# EAGLE design CANTensegrityBoard (EAGLE 6.5.0)

## Sheet 1 of 6
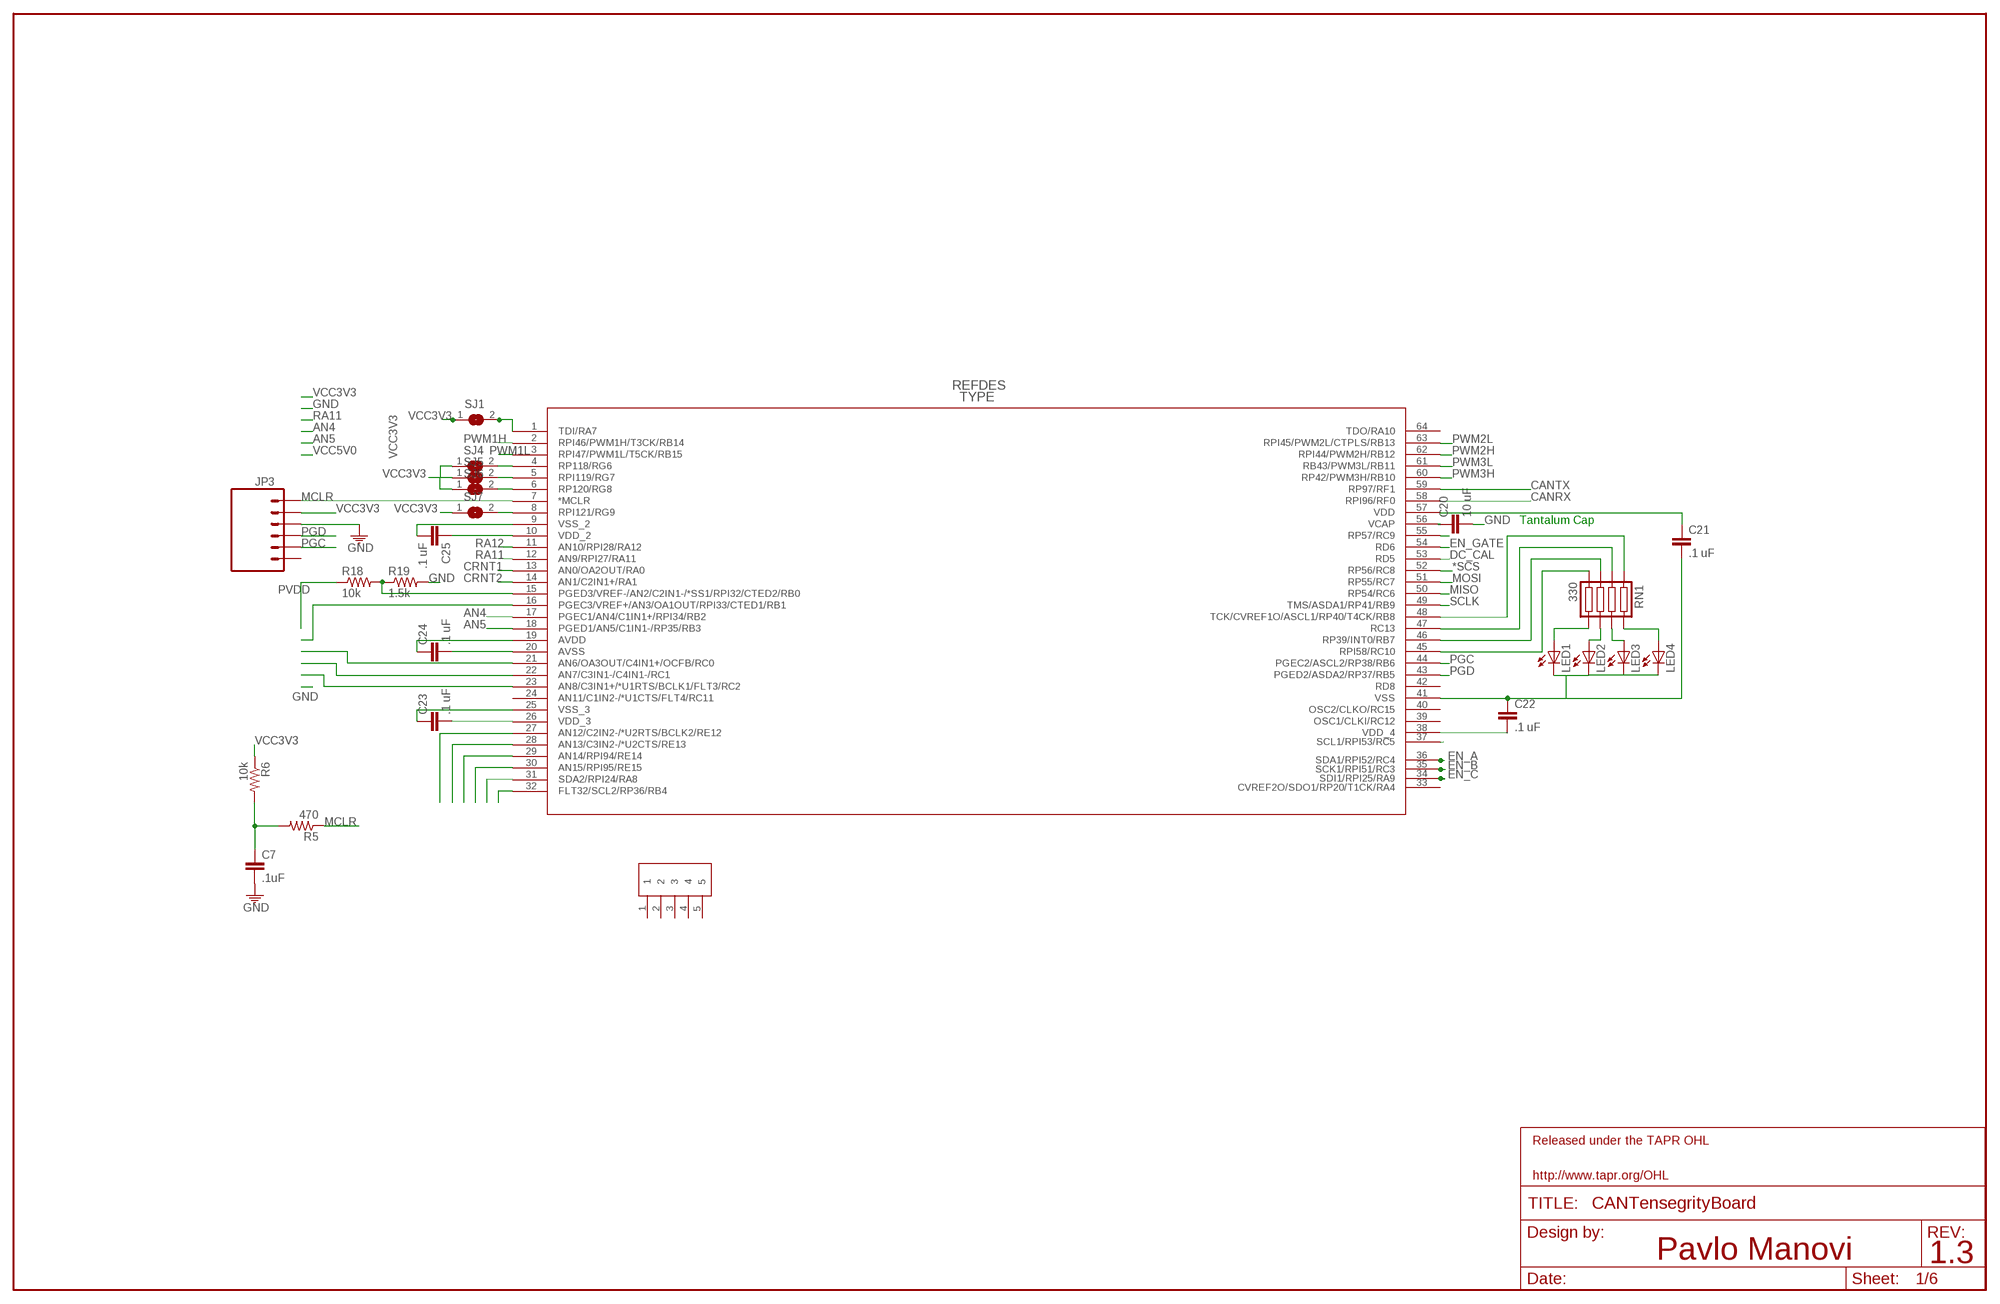
[diagram p0: schematic, sheet 1]

### Parts
C7  .1uF  CAP0805  [0805]
C20  10 uF  CAP1206  [1206]
C21  .1 uF  CAP0805  [0805]
C22  .1 uF  CAP0805  [0805]
C23  .1 uF  CAP0805  [0805]
C24  .1 uF  CAP0805  [0805]
C25  .1 uF  CAP0805  [0805]
JP3  M06LOCK  [1X06_LOCK]
LED1  LED0805  [LED-0805]
LED2  LED0805  [LED-0805]
LED3  LED0805  [LED-0805]
LED4  LED0805  [LED-0805]
R5  470  RESISTOR0805-RES  [0805]
R6  10k  RESISTOR0805-RES  [0805]
R18  10k  RESISTOR0805-RES  [0805]
R19  1.5k  RESISTOR0805-RES  [0805]
RN1  330  RESISTOR_ARRAY-4  [EXB-38V271JV]
SJ1  SJ  [SJ]
SJ4  SJ  [SJ]
SJ5  SJ  [SJ]
SJ6  SJ  [SJ]
SJ7  SJ  [SJ]
U$1  DSPIC33EP128MC502-I/SS  DSPIC33EP256MC50  [QFP64-10X10MC]
U$20  MICROCLASP5  [55932-0510]

### Nets
*SCS [Power]: U$1.52(RP56/RC8) ; also sheet 2
AN4: U$1.17(PGEC1/AN4/C1IN1+/RPI34/RB2)
AN5: U$1.18(PGED1/AN5/C1IN1-/RP35/RB3)
CANRX: U$1.58(RPI96/RF0) ; also sheet 4
CANTX: U$1.59(RP97/RF1) ; also sheet 4
CRNT1: U$1.13(AN0/OA2OUT/RA0) ; also sheet 2
CRNT2: U$1.14(AN1/C2IN1+/RA1) ; also sheet 2
DC_CAL: U$1.53(RD5) ; also sheet 2
EN_A: U$1.36(SDA1/RPI52/RC4) ; also sheet 6
EN_B: U$1.35(SCK1/RPI51/RC3) ; also sheet 6
EN_C: U$1.34(SDI1/RPI25/RA9) ; also sheet 6
EN_GATE: U$1.54(RD6) ; also sheet 2
GND: C7.2 C20.2 C21.2 C22.1 C23.1 C24.2 C25.2 JP3.3 LED1.2(C) LED2.2(C) LED3.2(C) LED4.2(C) R19.2 U$1.9(VSS_2) U$1.20(AVSS) U$1.25(VSS_3) U$1.41(VSS) ; also sheet 3,4,6
MCLR: JP3.1 R5.1 U$1.7(*MCLR)
MISO: U$1.50(RP54/RC6) ; also sheet 2
MOSI: U$1.51(RP55/RC7) ; also sheet 2
N$2: C7.1 R5.2 R6.2
N$5: SJ1.2 U$1.1(TDI/RA7)
N$25: R18.2 R19.1 U$1.15(PGED3/VREF-/AN2/C2IN1-/*SS1/RPI32/CTED2/RB0)
N$26: U$1.37(SCL1/RPI53/RC5)
N$27: SJ4.2 U$1.4(RP118/RG6)
N$28: SJ5.2 U$1.5(RPI119/RG7)
N$29: SJ6.2 U$1.6(RP120/RG8)
N$30: SJ7.2 U$1.8(RPI121/RG9)
N$31: C20.1 U$1.56(VCAP)
N$33: RN1.P$1 U$1.48(TCK/CVREF1O/ASCL1/RP40/T4CK/RB8)
N$41: RN1.P$2 U$1.47(RC13)
N$42: RN1.P$3 U$1.46(RP39/INT0/RB7)
N$43: RN1.P$4 U$1.45(RPI58/RC10)
N$44: LED1.1(A) RN1.P$5
N$45: LED2.1(A) RN1.P$6
N$46: LED3.1(A) RN1.P$7
N$47: LED4.1(A) RN1.P$8
N$48: U$1.32(FLT32/SCL2/RP36/RB4)
N$49: U$1.31(SDA2/RPI24/RA8)
N$50: U$1.30(AN15/RPI95/RE15)
N$51: U$1.29(AN14/RPI94/RE14)
N$52: U$1.28(AN13/C3IN2-/*U2CTS/RE13)
N$53: U$1.27(AN12/C2IN2-/*U2RTS/BCLK2/RE12)
N$55: U$1.16(PGEC3/VREF+/AN3/OA1OUT/RPI33/CTED1/RB1)
N$56: U$1.21(AN6/OA3OUT/C4IN1+/OCFB/RC0)
N$57: U$1.22(AN7/C3IN1-/C4IN1-/RC1)
N$58: U$1.23(AN8/C3IN1+/*U1RTS/BCLK1/FLT3/RC2)
PGC: JP3.5 U$1.44(PGEC2/ASCL2/RP38/RB6)
PGD [small]: JP3.4 U$1.43(PGED2/ASDA2/RP37/RB5)
PVDD [Power]: R18.1 ; also sheet 2,3,5
PWM1H: U$1.2(RPI46/PWM1H/T3CK/RB14) ; also sheet 2
PWM1L: U$1.3(RPI47/PWM1L/T5CK/RB15) ; also sheet 2
PWM2H: U$1.62(RPI44/PWM2H/RB12) ; also sheet 2
PWM2L: U$1.63(RPI45/PWM2L/CTPLS/RB13) ; also sheet 2
PWM3H: U$1.60(RP42/PWM3H/RB10) ; also sheet 2
PWM3L: U$1.61(RB43/PWM3L/RB11) ; also sheet 2
RA11: U$1.12(AN9/RPI27/RA11)
RA12: U$1.11(AN10/RPI28/RA12)
RC9: U$1.55(RP57/RC9)
SCLK: U$1.49(TMS/ASDA1/RP41/RB9) ; also sheet 2
VCC3V3 [Power]: C21.1 C22.2 C23.2 C24.1 C25.1 JP3.2 R6.1 SJ1.1 SJ4.1 SJ5.1 SJ6.1 SJ7.1 U$1.10(VDD_2) U$1.19(AVDD) U$1.26(VDD_3) U$1.38(VDD_4) U$1.57(VDD) ; also sheet 2,4,5,6
Unconnected: JP3.6 U$1.24(AN11/C1IN2-/*U1CTS/FLT4/RC11) U$1.33(CVREF2O/SDO1/RP20/T1CK/RA4) U$1.39(OSC1/CLKI/RC12) U$1.40(OSC2/CLKO/RC15) U$1.42(RD8) U$1.64(TDO/RA10) U$20.1 U$20.2 U$20.3 U$20.4 U$20.5

### Notes on the sheet
- Tantalum Cap

## Sheet 2 of 6
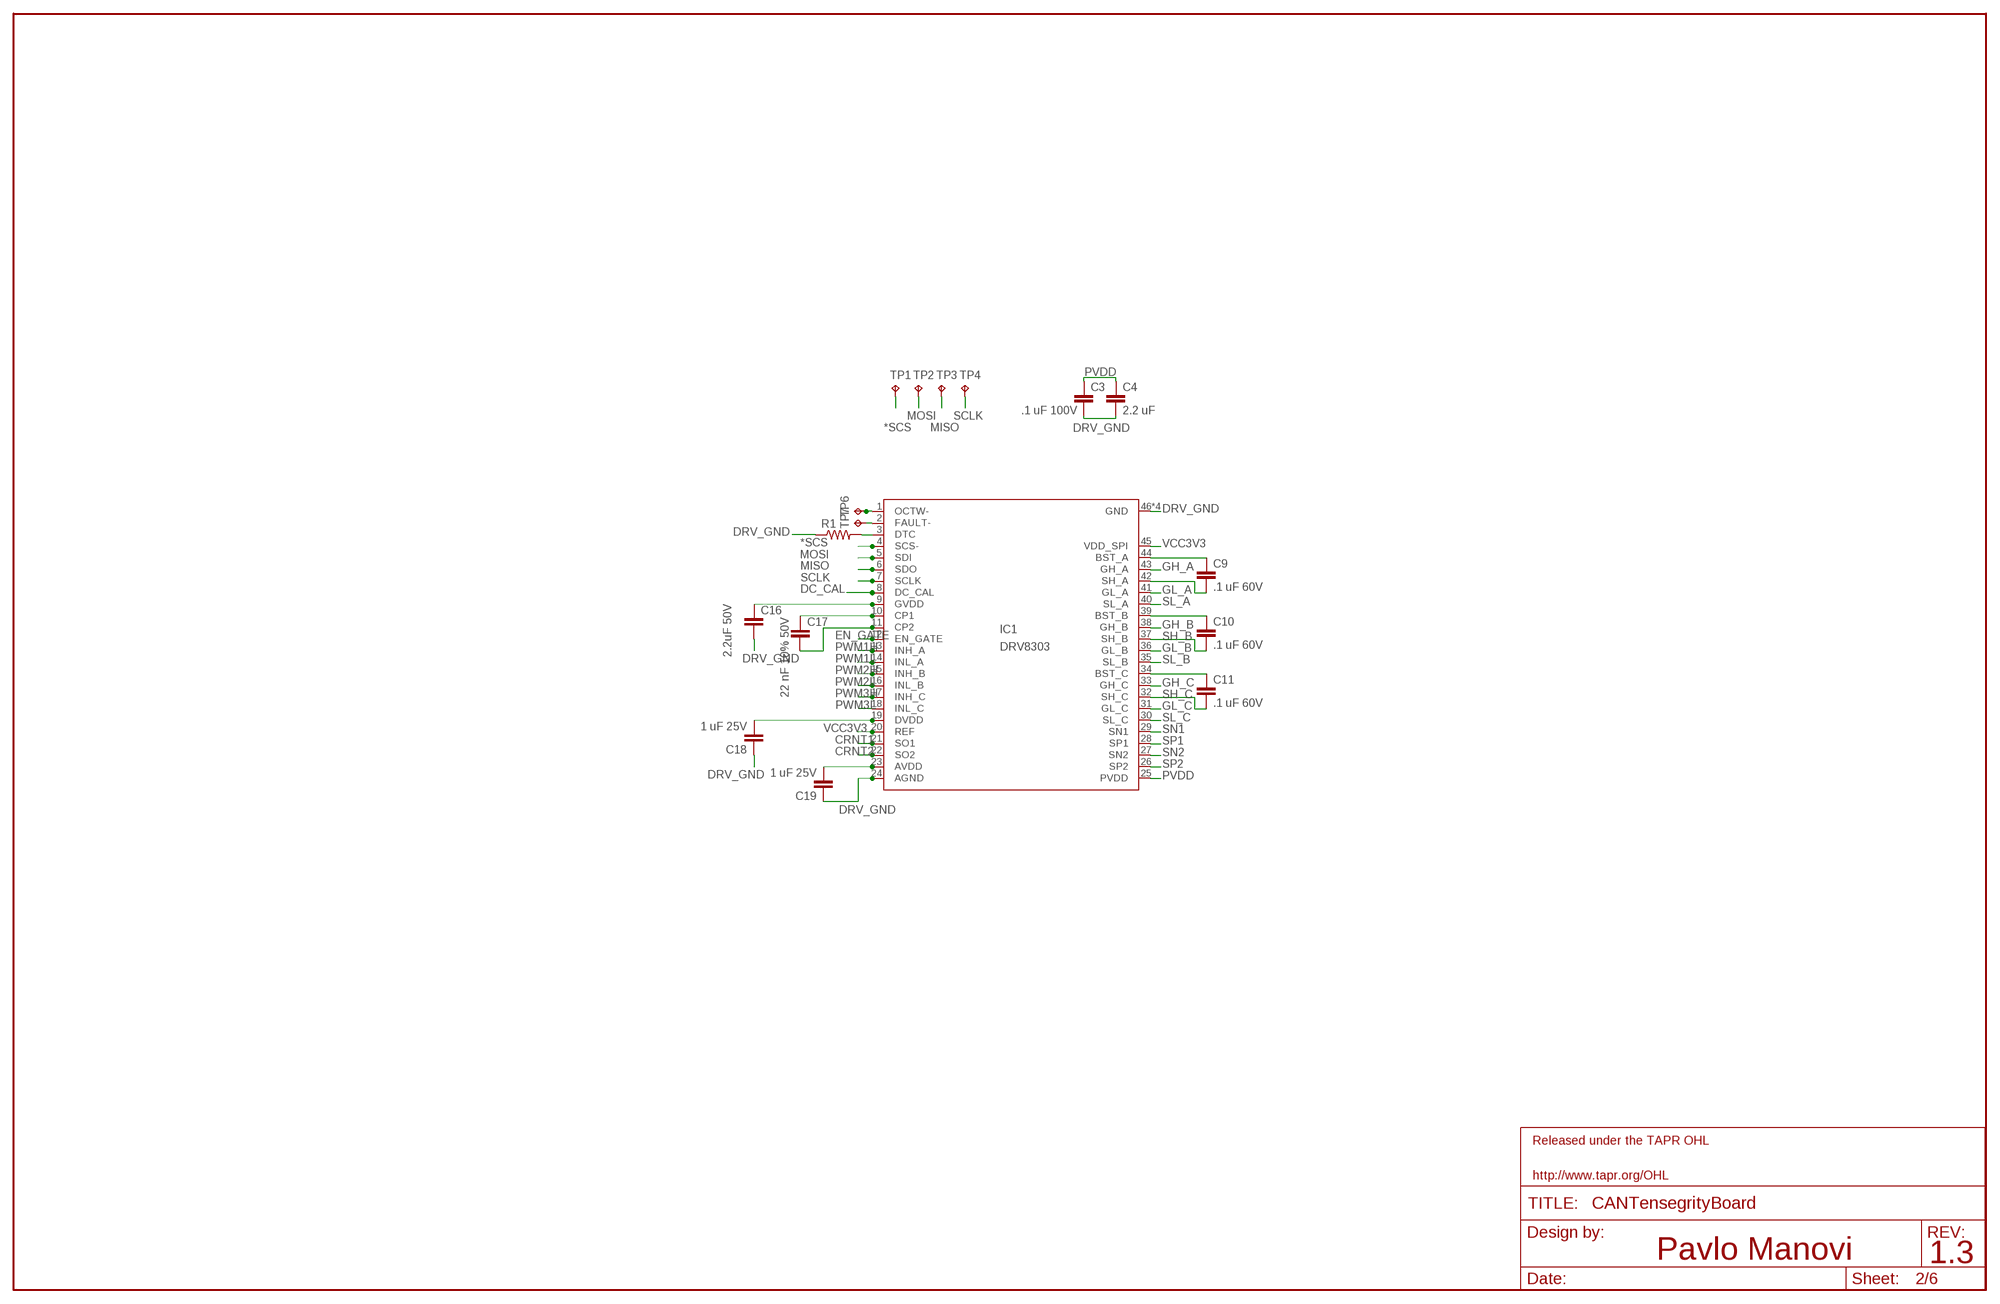
[diagram p1: schematic, sheet 2]

### Parts
C3  .1 uF 100V  CAP0805  [0805]
C4  2.2 uF  CAP0805  [0805]
C9  .1 uF 60V  CAP0805  [0805]
C10  .1 uF 60V  CAP0805  [0805]
C11  .1 uF 60V  CAP0805  [0805]
C16  2.2uF 50V  CAP1206  [1206]
C17  22 nF 10% 50V  CAP0805  [0805]
C18  1 uF 25V  CAP0805  [0805]
C19  1 uF 25V  CAP0805  [0805]
IC1  DRV8303  [HTSSOP-480-DCA]
R1  RESISTOR0805-RES  [0805]
TP1  TPTP06R  [TP06R]
TP2  TPTP06R  [TP06R]
TP3  TPTP06R  [TP06R]
TP4  TPTP06R  [TP06R]
TP6  TPTP06R  [TP06R]
TP7  TPTP06R  [TP06R]

### Nets
*SCS [Power]: IC1.4(SCS-) TP1.TP ; also sheet 1
BST_B: C10.1 IC1.39(BST_B)
BST_C: C11.1 IC1.34(BST_C)
CRNT1: IC1.21(SO1) ; also sheet 1
CRNT2: IC1.22(SO2) ; also sheet 1
DC_CAL: IC1.8(DC_CAL) ; also sheet 1
DRV_GND [Power]: C3.2 C4.2 C16.2 C18.1 C19.1 IC1.24(AGND) IC1.46(GND) IC1.47(GND) IC1.48(GND) IC1.49(GND) R1.1 ; also sheet 3
EN_GATE: IC1.12(EN_GATE) ; also sheet 1
GH_A: IC1.43(GH_A) ; also sheet 3
GH_B: IC1.38(GH_B) ; also sheet 3
GH_C: IC1.33(GH_C) ; also sheet 3
GL_A: IC1.41(GL_A) ; also sheet 3
GL_B: IC1.36(GL_B) ; also sheet 3
GL_C: IC1.31(GL_C) ; also sheet 3
MISO: IC1.6(SDO) TP3.TP ; also sheet 1
MOSI: IC1.5(SDI) TP2.TP ; also sheet 1
N$1: IC1.3(DTC) R1.2
N$4: C9.1 IC1.44(BST_A)
N$12: IC1.1(OCTW-) TP6.TP
N$18: C16.1 IC1.9(GVDD)
N$19: C17.1 IC1.10(CP1)
N$20: C17.2 IC1.11(CP2)
N$21: C18.2 IC1.19(DVDD)
N$22: C19.2 IC1.23(AVDD)
N$24: IC1.2(FAULT-) TP7.TP
PVDD [Power]: C3.1 C4.1 IC1.25(PVDD) ; also sheet 1,3,5
PWM1H: IC1.13(INH_A) ; also sheet 1
PWM1L: IC1.14(INL_A) ; also sheet 1
PWM2H: IC1.15(INH_B) ; also sheet 1
PWM2L: IC1.16(INL_B) ; also sheet 1
PWM3H: IC1.17(INH_C) ; also sheet 1
PWM3L: IC1.18(INL_C) ; also sheet 1
SCLK: IC1.7(SCLK) TP4.TP ; also sheet 1
SH_A: C9.2 IC1.42(SH_A) ; also sheet 3
SH_B: C10.2 IC1.37(SH_B) ; also sheet 3
SH_C: C11.2 IC1.32(SH_C) ; also sheet 3
SL_A: IC1.40(SL_A) ; also sheet 3
SL_B [Power]: IC1.35(SL_B) ; also sheet 3
SL_C: IC1.30(SL_C) ; also sheet 3
SN1: IC1.29(SN1) ; also sheet 3
SN2: IC1.27(SN2) ; also sheet 3
SP1 [Power]: IC1.28(SP1) ; also sheet 3
SP2 [Power]: IC1.26(SP2) ; also sheet 3
VCC3V3 [Power]: IC1.20(REF) IC1.45(VDD_SPI) ; also sheet 1,4,5,6

## Sheet 3 of 6
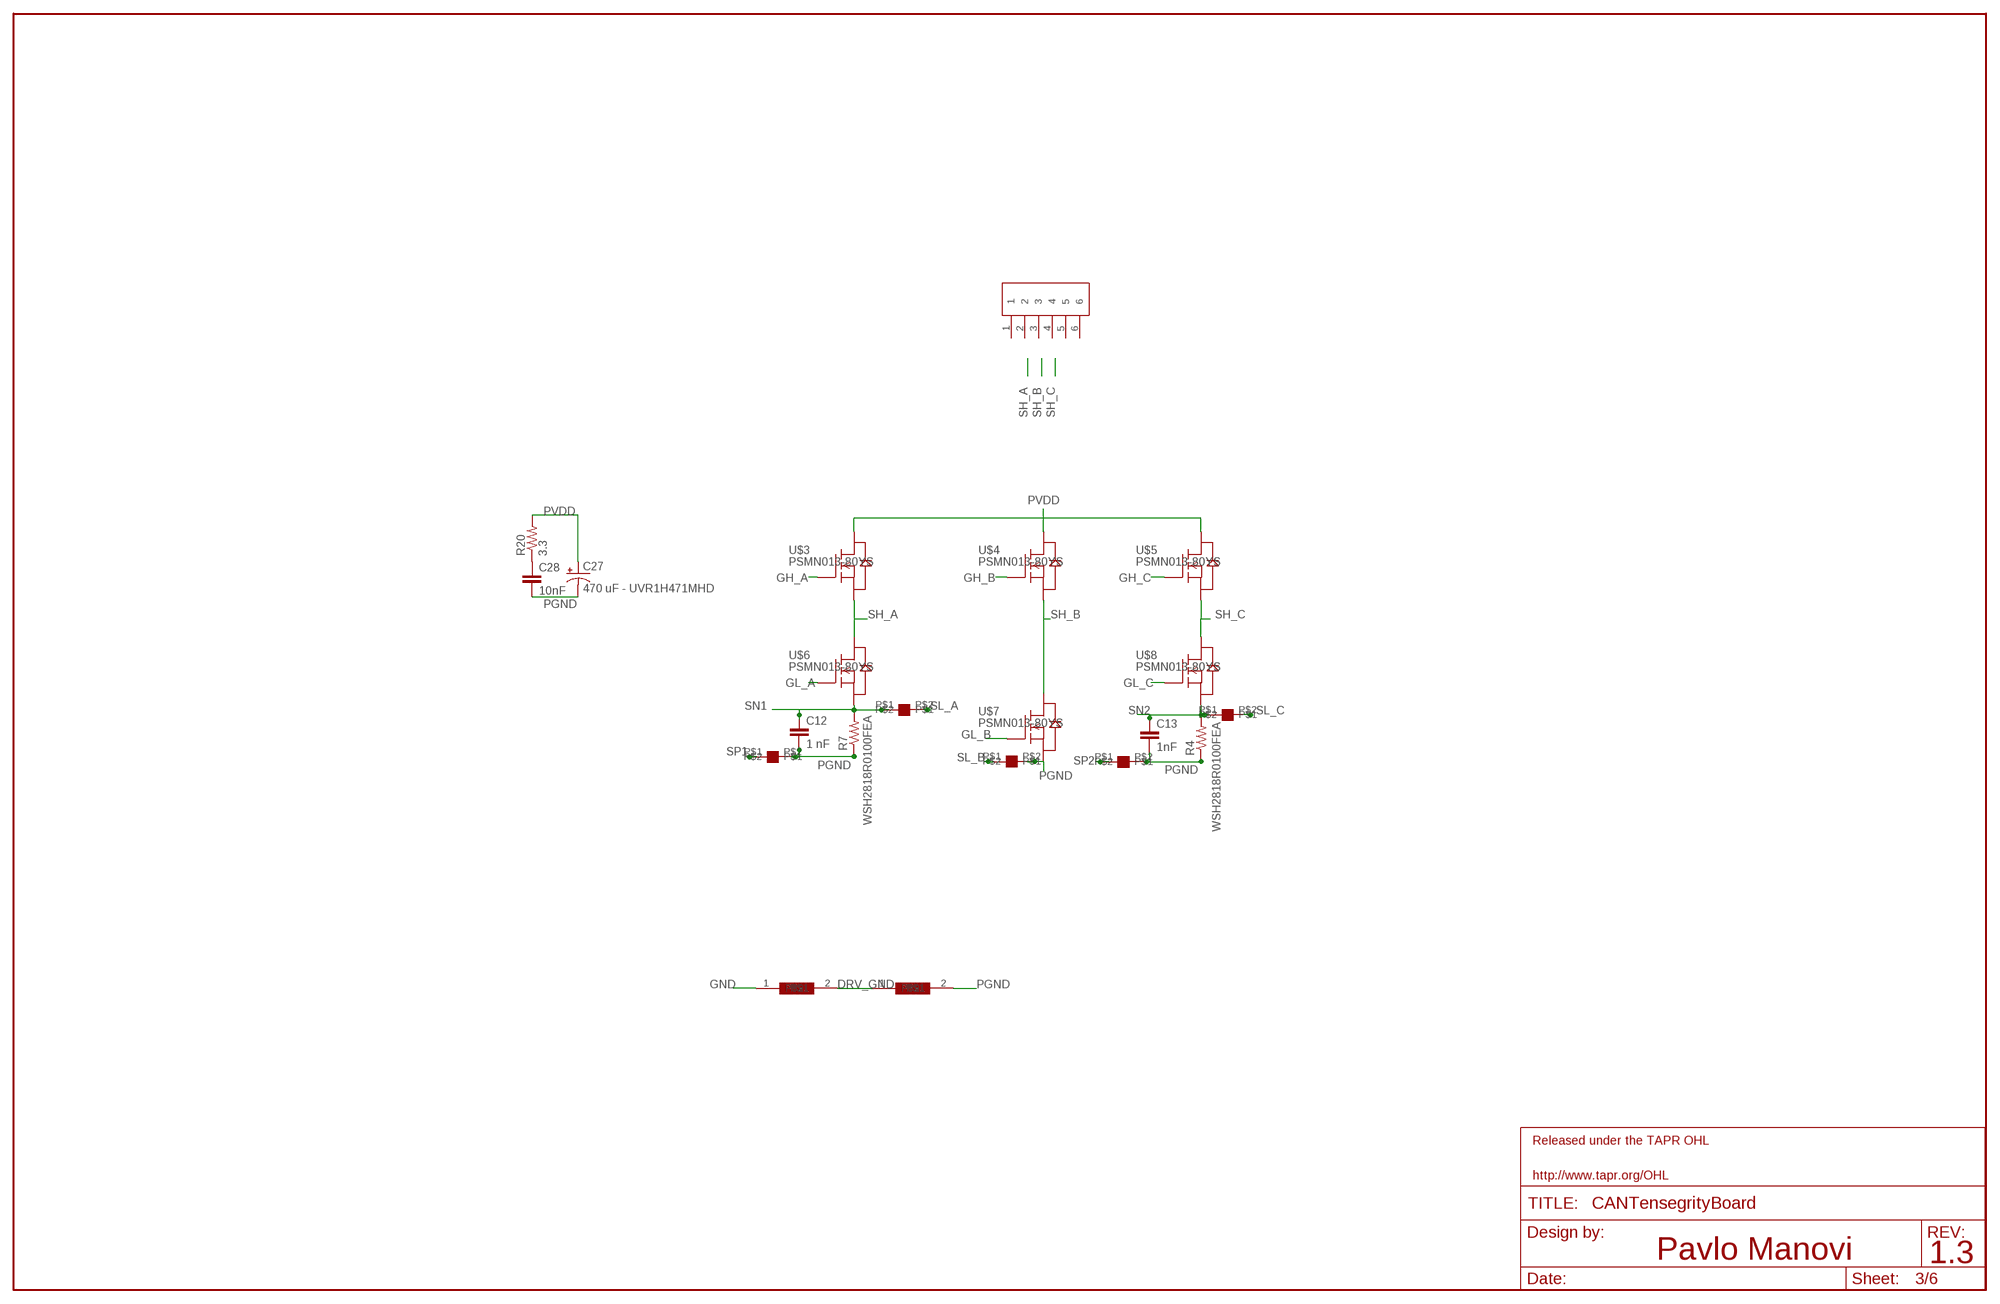
[diagram p2: schematic, sheet 3]

### Parts
C12  1 nF  CAP0805  [0805]
C13  1nF  CAP0805  [0805]
C27  470 uF - UVR1H471MHD  CAP_POLPTH4  [CPOL-RADIAL-1000UF-25V]
C28  10nF  CAP0805  [0805]
R4  WSH2818R0100FEA  RESISTOR  [SMT-REF]
R7  WSH2818R0100FEA  RESISTOR  [SMT-REF]
R20  3.3  RESISTOR0805-RES  [0805]
U9  H1206T500R-10  [1206]
U10  H1206T500R-10  [1206]
U$2  NETJUMPER  [NETJUMPER]
U$3  PSMN013-80YS  [TO127P600X120-5N]
U$4  PSMN013-80YS  [TO127P600X120-5N]
U$5  PSMN013-80YS  [TO127P600X120-5N]
U$6  PSMN013-80YS  [TO127P600X120-5N]
U$7  PSMN013-80YS  [TO127P600X120-5N]
U$8  PSMN013-80YS  [TO127P600X120-5N]
U$9  NETJUMPER  [NETJUMPER]
U$10  NETJUMPER  [NETJUMPER]
U$11  NETJUMPER  [NETJUMPER]
U$12  NETJUMPER  [NETJUMPER]
U$17  MINIFITJR6PIN  [0039288060]

### Nets
DRV_GND [Power]: U9.2 U10.1 ; also sheet 2
GH_A: U$3.4(G) ; also sheet 2
GH_B: U$4.4(G) ; also sheet 2
GH_C: U$5.4(G) ; also sheet 2
GL_A: U$6.4(G) ; also sheet 2
GL_B: U$7.4(G) ; also sheet 2
GL_C: U$8.4(G) ; also sheet 2
GND: U9.1 ; also sheet 1,4,6
N$6: C28.1 R20.1
PGND [Power]: C12.2 C13.2 C27.2(-) C28.2 R4.1 R7.1 U10.2 U$2.P$2 U$7.1(S) U$7.2(S) U$7.3(S) U$10.P$2 U$11.P$2 ; also sheet 5
PVDD [Power]: C27.1(+) R20.2 U$3.5(D) U$3.P$1(D) U$3.P$2(D) U$3.P$3(D) U$3.P$4(D) U$3.P$5(D) U$3.P$6(D) U$3.P$7(D) U$3.P$8(D) U$3.P$9(D) U$4.5(D) U$4.P$1(D) U$4.P$2(D) U$4.P$3(D) U$4.P$4(D) U$4.P$5(D) U$4.P$6(D) U$4.P$7(D) U$4.P$8(D) U$4.P$9(D) U$5.5(D) U$5.P$1(D) U$5.P$2(D) U$5.P$3(D) U$5.P$4(D) U$5.P$5(D) U$5.P$6(D) U$5.P$7(D) U$5.P$8(D) U$5.P$9(D) ; also sheet 1,2,5
SH_A: U$3.1(S) U$3.2(S) U$3.3(S) U$6.5(D) U$6.P$1(D) U$6.P$2(D) U$6.P$3(D) U$6.P$4(D) U$6.P$5(D) U$6.P$6(D) U$6.P$7(D) U$6.P$8(D) U$6.P$9(D) ; also sheet 2
SH_B: U$4.1(S) U$4.2(S) U$4.3(S) U$7.5(D) U$7.P$1(D) U$7.P$2(D) U$7.P$3(D) U$7.P$4(D) U$7.P$5(D) U$7.P$6(D) U$7.P$7(D) U$7.P$8(D) U$7.P$9(D) ; also sheet 2
SH_C: U$5.1(S) U$5.2(S) U$5.3(S) U$8.5(D) U$8.P$1(D) U$8.P$2(D) U$8.P$3(D) U$8.P$4(D) U$8.P$5(D) U$8.P$6(D) U$8.P$7(D) U$8.P$8(D) U$8.P$9(D) ; also sheet 2
SL_A: U$9.P$2 ; also sheet 2
SL_B [Power]: U$10.P$1 ; also sheet 2
SL_C: U$12.P$2 ; also sheet 2
SN1: C12.1 R7.2 U$6.1(S) U$6.2(S) U$6.3(S) U$9.P$1 ; also sheet 2
SN2: C13.1 R4.2 U$8.1(S) U$8.2(S) U$8.3(S) U$12.P$1 ; also sheet 2
SP1 [Power]: U$2.P$1 ; also sheet 2
SP2 [Power]: U$11.P$1 ; also sheet 2
Unconnected: U$17.1 U$17.2 U$17.3 U$17.4 U$17.5 U$17.6

## Sheet 4 of 6
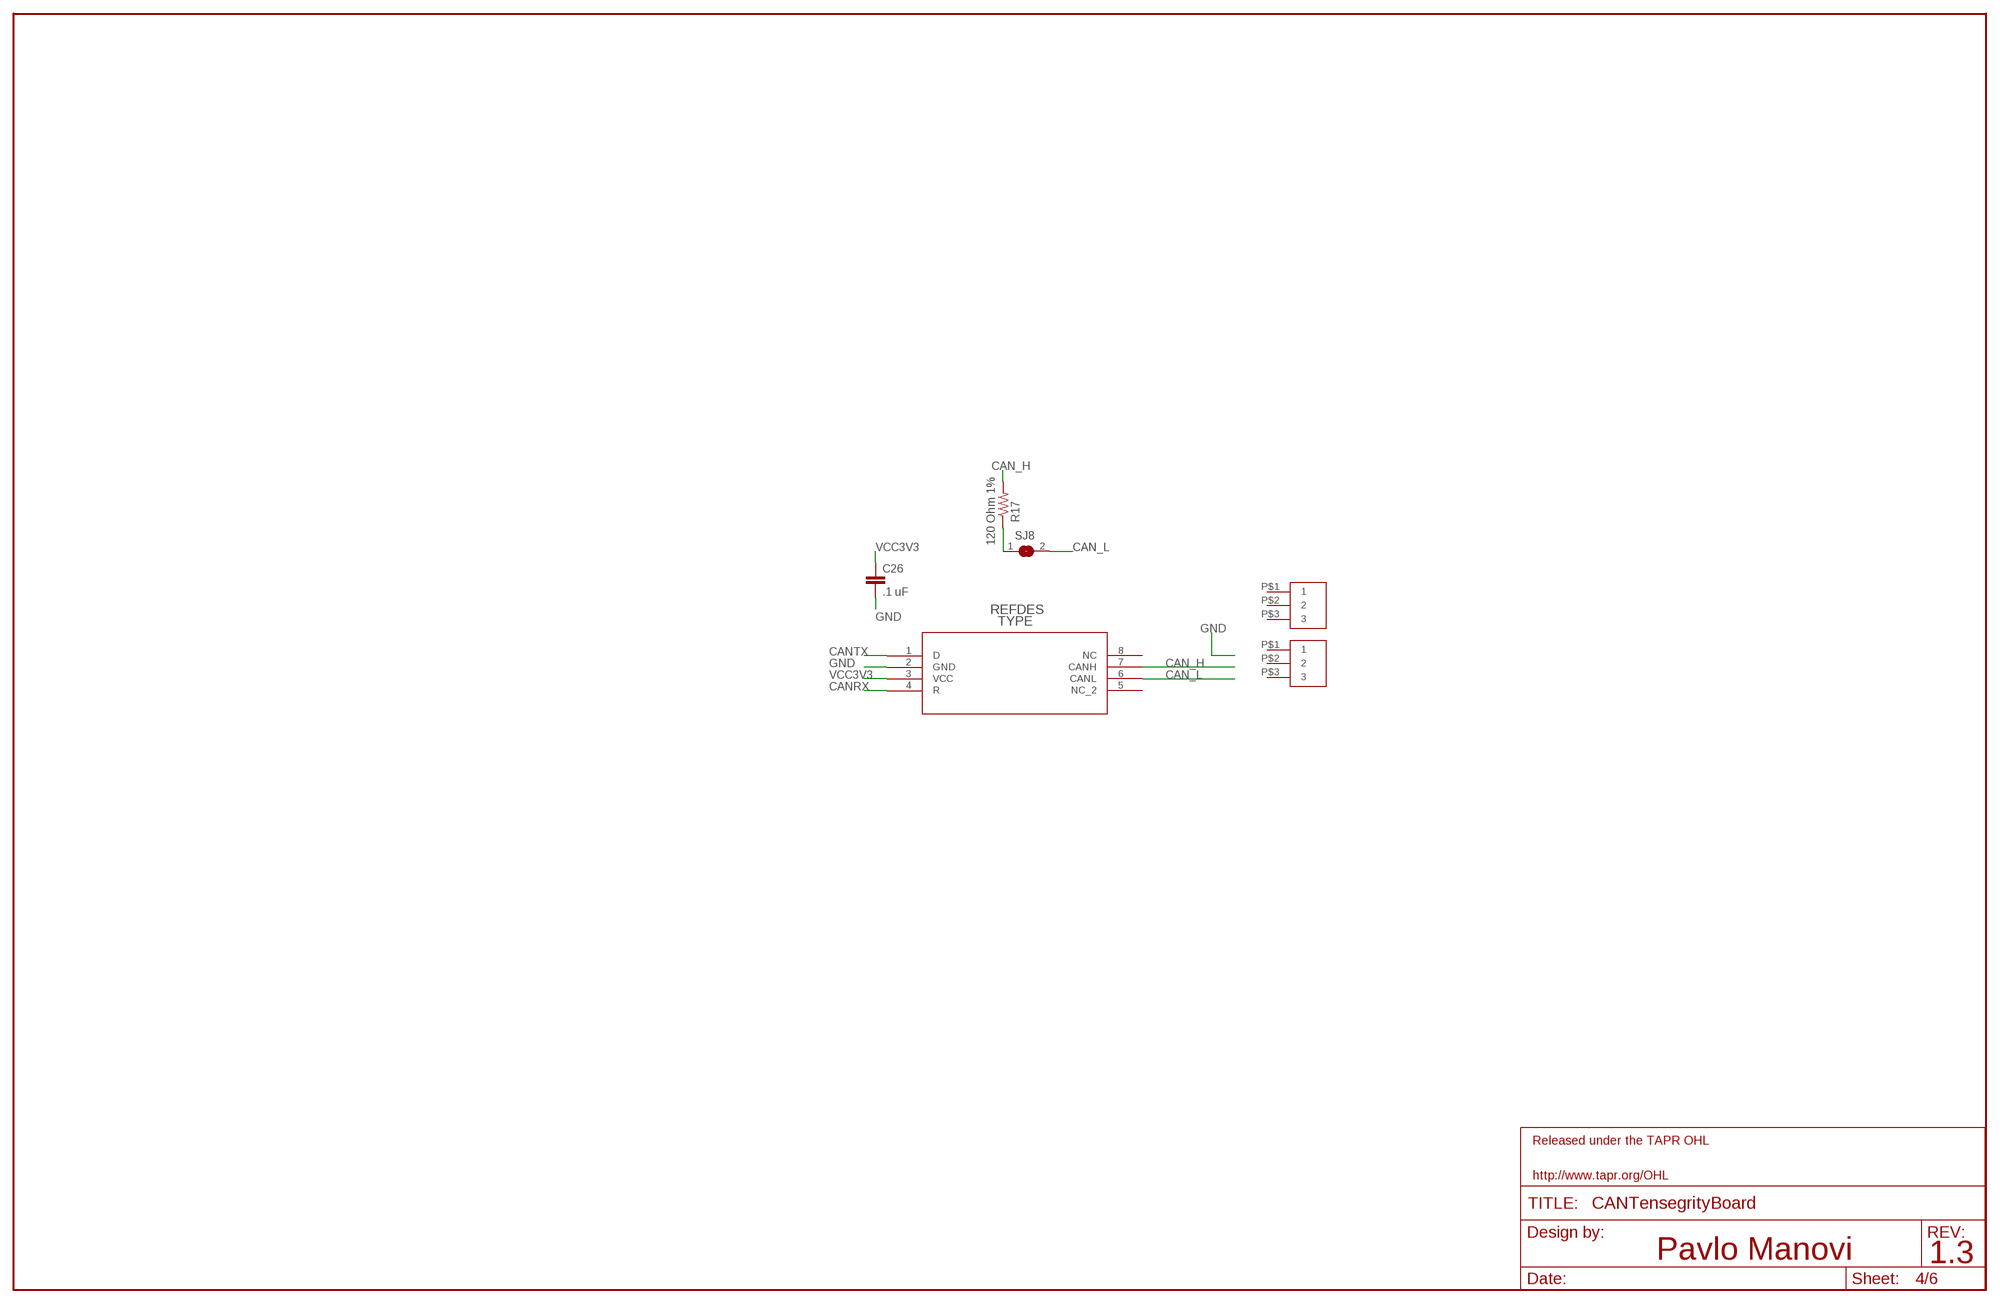
[diagram p3: schematic, sheet 4]

### Parts
C26  .1 uF  CAP0805  [0805]
R17  120 Ohm 1%  RESISTOR0805-RES  [0805]
SJ8  SJ  [SJ]
U2  SN65HVD232_D_8  [D8]
U$14  MICROCLASP3  [55932-0310]
U$19  MICROCLASP3  [55932-0310]

### Nets
CAN_H: R17.2 U2.7(CANH)
CAN_L: SJ8.2 U2.6(CANL)
CANRX: U2.4(R) ; also sheet 1
CANTX: U2.1(D) ; also sheet 1
GND: C26.2 U2.2(GND) ; also sheet 1,3,6
N$64: R17.1 SJ8.1
VCC3V3 [Power]: C26.1 U2.3(VCC) ; also sheet 1,2,5,6
Unconnected: U2.5(NC_2) U2.8(NC) U$14.P$1 U$14.P$2 U$14.P$3 U$19.P$1 U$19.P$2 U$19.P$3

## Sheet 5 of 6
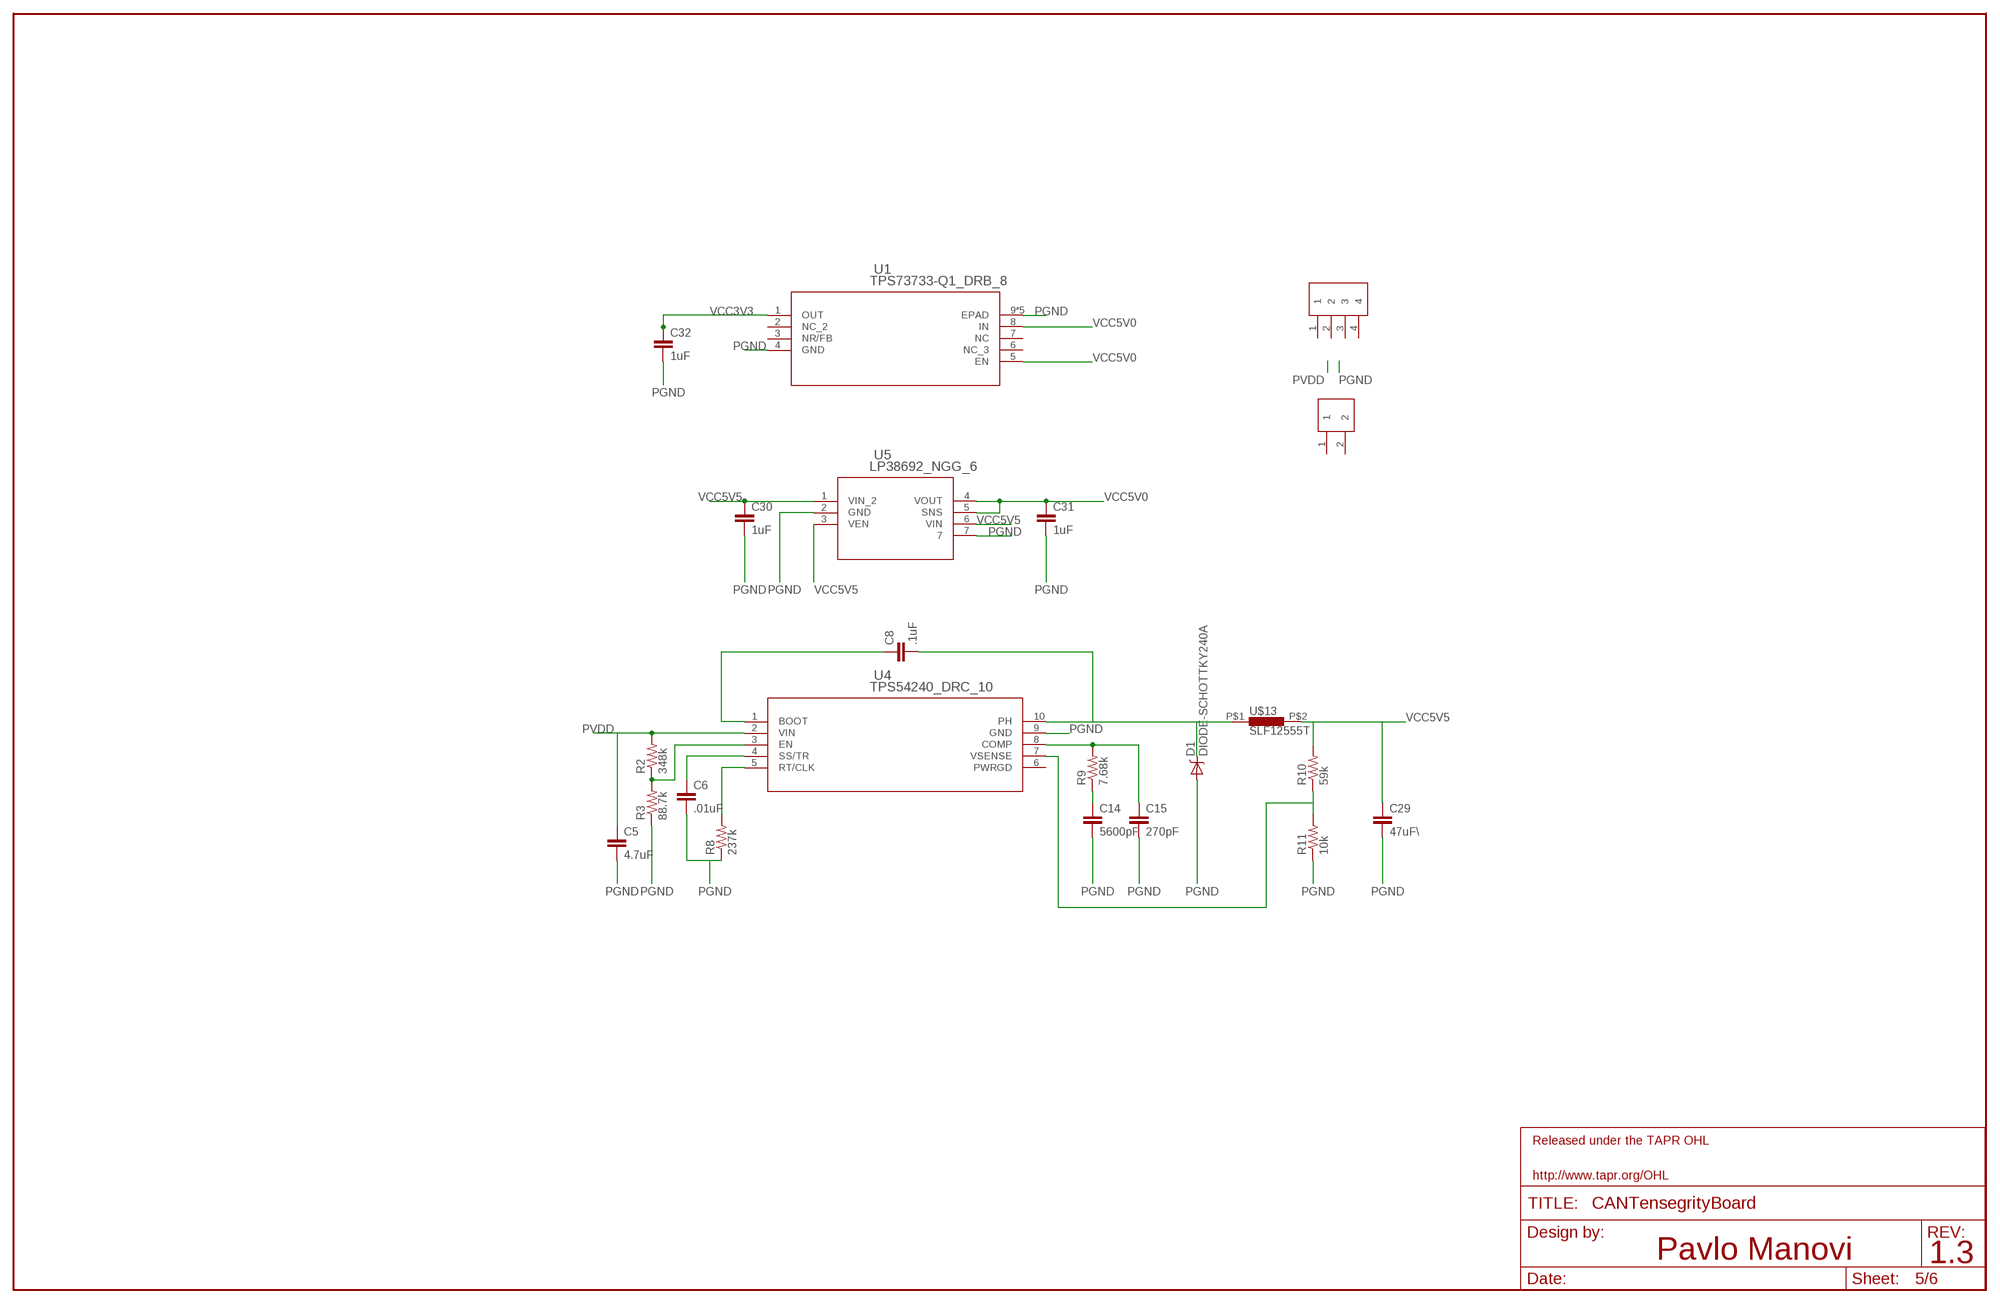
[diagram p4: schematic, sheet 5]

### Parts
C5  4.7uF  CAP1210  [1210]
C6  .01uF  CAP0805  [0805]
C8  .1uF  CAP0805  [0805]
C14  5600pF  CAP0805  [0805]
C15  270pF  CAP0805  [0805]
C29  47uF\  CAP  [C2220K]
C30  1uF  CAP0805  [0805]
C31  1uF  CAP0805  [0805]
C32  1uF  CAP0805  [0805]
D1  DIODE-SCHOTTKY240A  [SMA-DIODE-B240A]
R2  348k  RESISTOR0805-RES  [0805]
R3  88.7k  RESISTOR0805-RES  [0805]
R8  237k  RESISTOR0805-RES  [0805]
R9  7.68k  RESISTOR0805-RES  [0805]
R10  59k  RESISTOR0805-RES  [0805]
R11  10k  RESISTOR0805-RES  [0805]
U1  TPS73733-Q1_DRB_8  [DRB8_1P75X1P5]
U4  TPS54240_DRC_10  [DRC10_2P4X1P65]
U5  LP38692_NGG_6  [SDE06A]
U$13  SLF12555T  [SLF12555]
U$16  MINIFITJR4PIN  [0039288040]
U$18  MICROCLASP2  [55932-0210]

### Nets
N$7: R2.1 R3.2 U4.3(EN)
N$8: C6.1 U4.4(SS/TR)
N$9: R8.2 U4.5(RT/CLK)
N$10: C8.1 U4.1(BOOT)
N$13: C8.2 D1.C U4.10(PH) U$13.P$1
N$14: C15.1 R9.2 U4.8(COMP)
N$15: C14.1 R9.1
N$16: R10.1 R11.2 U4.7(VSENSE)
PGND [Power]: C5.2 C6.2 C14.2 C15.2 C29.2 C30.2 C31.2 C32.2 D1.A R3.1 R8.1 R11.1 U1.4(GND) U1.9(EPAD) U1.P$1(EPAD) U1.P$2(EPAD) U1.P$3(EPAD) U1.P$4(EPAD) U4.9(GND) U5.2(GND) U5.7 ; also sheet 3
PVDD [Power]: C5.1 R2.2 U4.2(VIN) ; also sheet 1,2,3
VCC3V3 [Power]: C32.1 U1.1(OUT) ; also sheet 1,2,4,6
VCC5V0: C31.1 U1.5(EN) U1.8(IN) U5.4(VOUT) U5.5(SNS) ; also sheet 1
VCC5V5: C29.1 C30.1 R10.2 U5.1(VIN_2) U5.3(VEN) U5.6(VIN) U$13.P$2
Unconnected: U1.2(NC_2) U1.3(NR/FB) U1.6(NC_3) U1.7(NC) U4.6(PWRGD) U$16.1 U$16.2 U$16.3 U$16.4 U$18.1 U$18.2

## Sheet 6 of 6
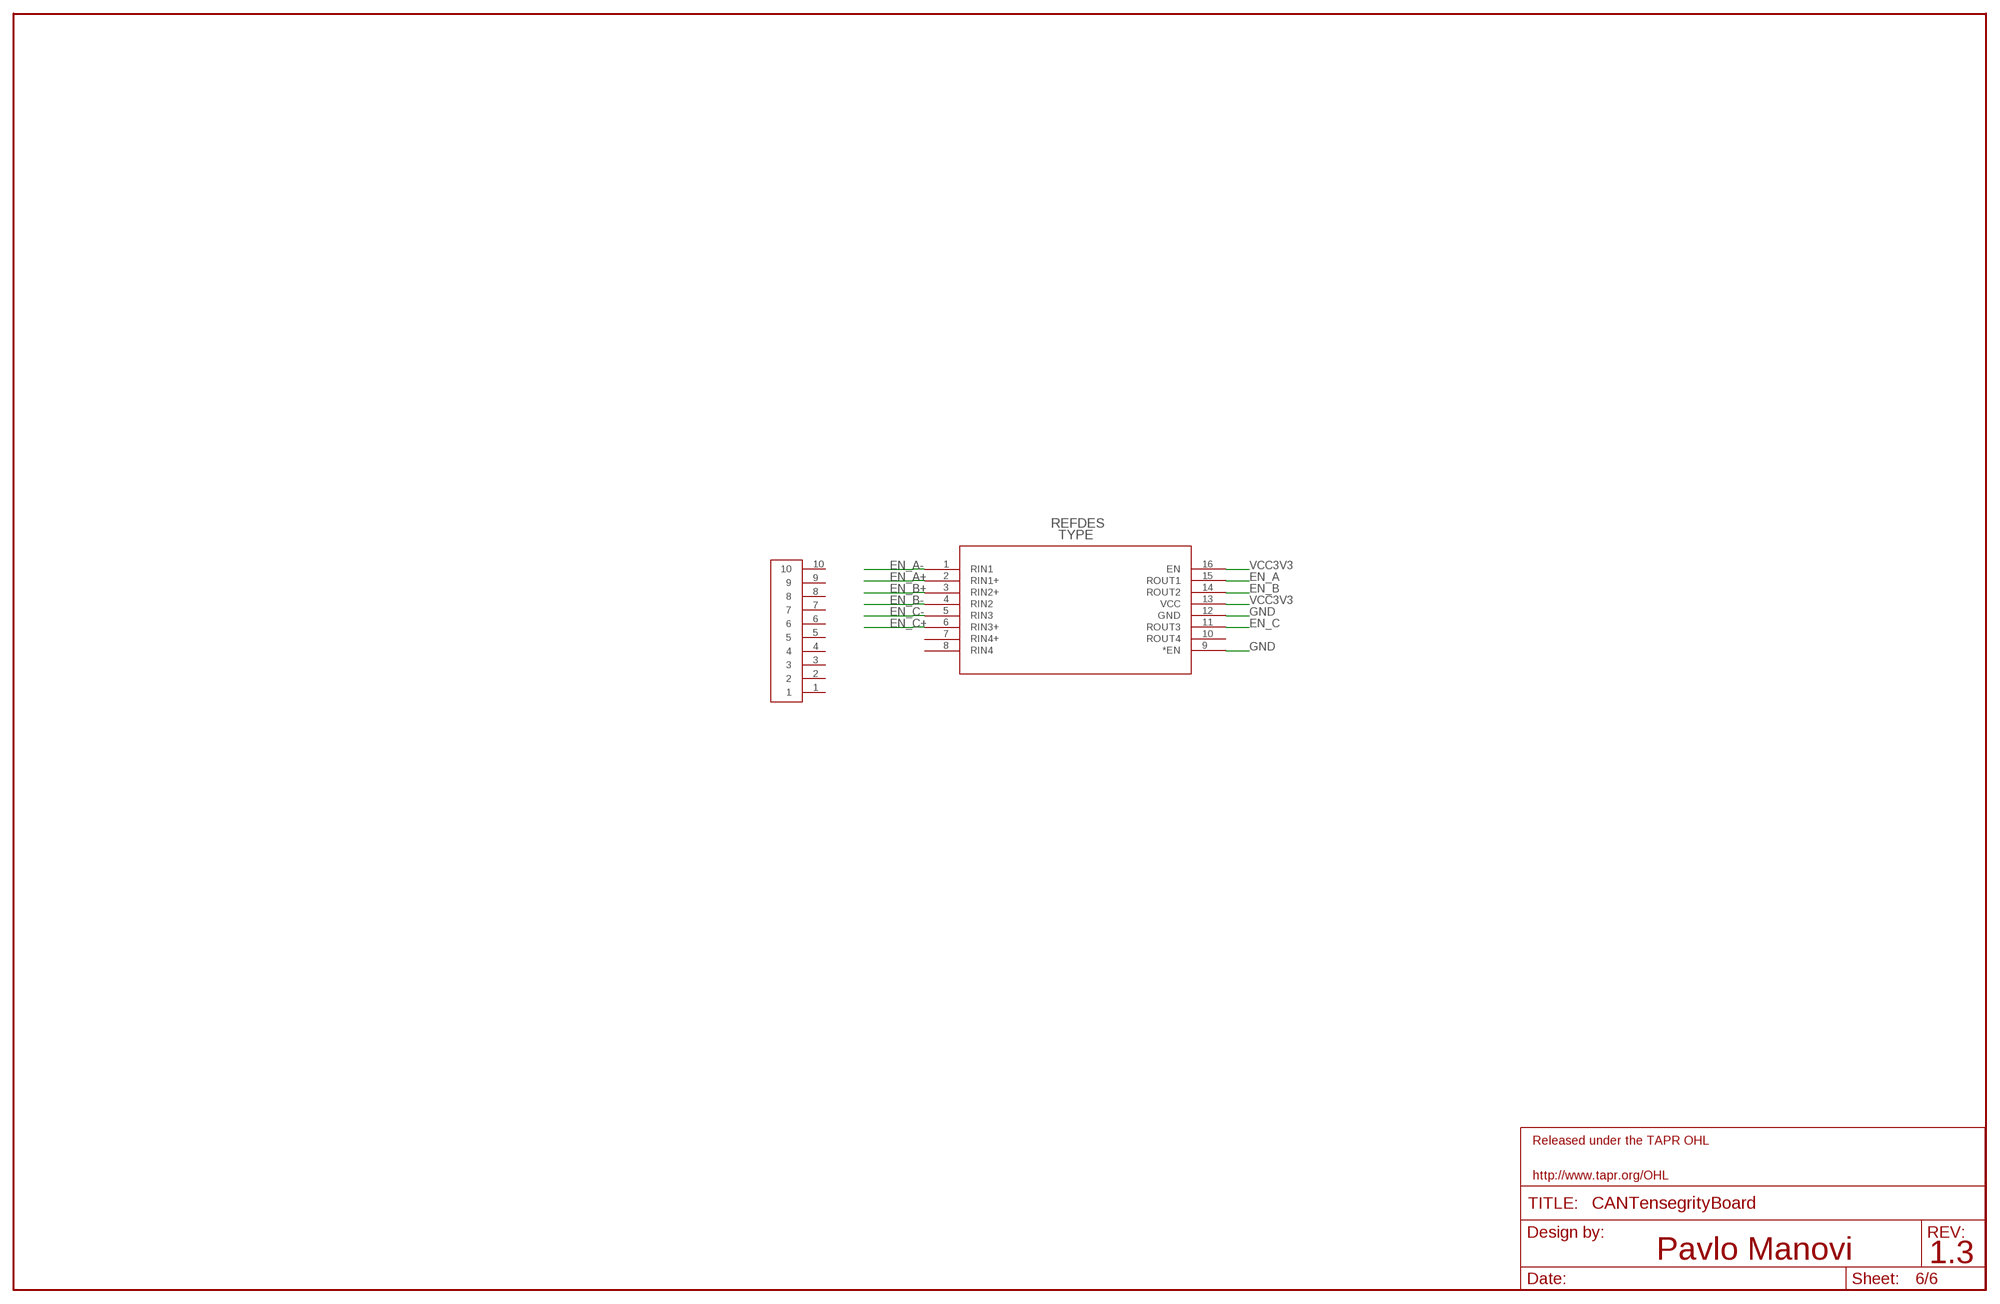
[diagram p5: schematic, sheet 6]

### Parts
U3  SN65LVDT348_PW_1  [PW16]
U$15  3M10PIN2500  [FOUR-WALL-2500-LP-STH]

### Nets
EN_A: U3.15(ROUT1) ; also sheet 1
EN_A+: U3.2(RIN1+)
EN_A-: U3.1(RIN1)
EN_B: U3.14(ROUT2) ; also sheet 1
EN_B+: U3.3(RIN2+)
EN_B-: U3.4(RIN2)
EN_C: U3.11(ROUT3) ; also sheet 1
EN_C+: U3.6(RIN3+)
EN_C-: U3.5(RIN3)
GND: U3.9(*EN) U3.12(GND) ; also sheet 1,3,4
VCC3V3 [Power]: U3.13(VCC) U3.16(EN) ; also sheet 1,2,4,5
Unconnected: U3.7(RIN4+) U3.8(RIN4) U3.10(ROUT4) U$15.1 U$15.2 U$15.3 U$15.4 U$15.5 U$15.6 U$15.7 U$15.8 U$15.9 U$15.10

## Library data of the parts
C3 C4 C7 C9-C13 C16-C26 C28 = ASL:CAP: Capacitor Standard 0603 ceramic capacitor, and 0.1" leaded capacitor.
C5 C6 C8 C14 C15 C29-C32 = SwitcherPowerStage:CAP: Capacitor Standard 0603 ceramic capacitor, and 0.1" leaded capacitor.
C27 = ASL:CAP_POL: Capacitor Polarized These are standard SMD and PTH capacitors. Normally 10uF, 47uF, and 100uF in electrolytic and tantalum varieties. Always verify the external diameter of the through hole cap, it varies with capacity, voltage, and manufacturer. The EIA devices should be standard.
D1 = SwitcherPowerStage:DIODE-SCHOTTKY
IC1 = OpenPMSM:DRV8303: edit this description Auto generated by make-symbol-device-package-bsdl.ulp Rev. 43 Source:
JP3 = CMPE118lib:M06: Header 6 Standard 6-pin 0.1" header. Use with straight break away headers (SKU : PRT-00116), right angle break away headers (PRT-00553), swiss pins (PRT-00743), machine pins (PRT-00117), and female headers (PRT-00115). Molex polarized connector foot print use with SKU : PRT-08094 with associated crimp pins and housings. NOTES ON THE VARIANTS LOCK and LOCK_LONGPADS... This footprint was designed to help hold the alignment of a through-hole component (i.e. 6-pin header) while soldering it into place. You may notice that each hole has been shifted either up or down by 0.005 of an inch from it's more standard position (which is a perfectly straight line). This slight alteration caused the pins (the squares in the middle) to touch the edges of the holes. Because they are alternating, it causes a "brace" to hold the component in place. 0.005 has proven to be the perfect amount of "off-center" position when using our standard breakaway headers. Although looks a little odd when you look at the bare footprint, once you have a header in there, the alteration is very hard to notice. Also, if you push a header all the way into place, it is covered up entirely on the bottom side. This idea of altering the position of holes to aid alignment will be further integrated into the Sparkfun Library for other footprints. It can help hold any component with 3 or more connection pins.
LED1-LED4 = ASL:LED: LEDs Standard schematic elements and footprints for 5mm, 3mm, 1206, and 0603 sized LEDs. 5mm - Spark Fun Electronics SKU : COM-00529 (and others)
R1 R17-R20 = ASL:RESISTOR: Resistor Basic schematic elements and footprints for 0603, 1206, and PTH resistors.
R2 R3 R8-R11 = SwitcherPowerStage:RESISTOR: Resistor Basic schematic elements and footprints for 0603, 1206, and PTH resistors.
R4 R7 = pavlo:RESISTOR: Resistor Basic schematic elements and footprints for 0603, 1206, and PTH resistors.
R5 R6 = CMPE118lib:RESISTOR: Resistor Basic schematic elements and footprints for 0603, 1206, and PTH resistors.
RN1 = ASL:RESISTOR_ARRAY-4: Chip Resistor Array 4 Single Resistor Source: http://industrial.panasonic.com/www-data/pdf/AOC0000/AOC0000PE2.pdf; OC_FARNELL: unknown; OC_NEWARK: unknown
SJ1 SJ4-SJ8 = jumper:SJ: SMD solder JUMPER
TP1-TP4 TP6 TP7 = testpad:TP: Test pad
U1 = SwitcherPowerStage:TPS73733-Q1_DRB_8; DATASHEETURL: http://www.ti.com/lit/gpn/TPS73733-Q1; DESCRIPTION: Automotive Catalog Automotive Catalog Single Output LDO, 1A, Fixed (3.3V), Reverse Current Protect; FAMILY_NAME: SINGLE CHANNEL LDO; GENERIC_PART_NUMBER: TPS73733-Q1; INDUSTRY_STD_PKG_TYPE: SON; MANUFACTURER: Texas Instruments; MANUFACTURER_PART_NUMBER: tps73733-q1_drb_8; PACKAGE_DESIGNATOR: DRB; PIN_COUNT: 8; VENDOR: Texas Instruments
U2 = pavlo:SN65HVD232_D_8
U3 = pavlo:SN65LVDT348_PW_1
U4 = SwitcherPowerStage:TPS54240_DRC_10; DATASHEETURL: http://www.ti.com/lit/gpn/TPS54240; DESCRIPTION: 3.5V to 42V Input, 2.5A Step-Down Converter with Eco-Mode; FAMILY_NAME: STEP-DOWN REGULATOR; GENERIC_PART_NUMBER: TPS54240; INDUSTRY_STD_PKG_TYPE: SON; MANUFACTURER: Texas Instruments; MANUFACTURER_PART_NUMBER: tps54240_drc_10; PACKAGE_DESIGNATOR: DRC; PIN_COUNT: 10; VENDOR: Texas Instruments
U5 = SwitcherPowerStage:LP38692_NGG_6; BASE_PN: LP38692; COMP: TypeLDO; LIBRARY: ReferenceLP38692SD; PARTNUMBER: LP38692SD-18; PIN: Count6; SYMBOL: NameLP38692SD-18; TYPE: LP38692SD-1.8; VENDOR: NationalSemiconductor; VERSION: 1
U9 U10 = pavlo:H1206T500R-10
U$1 = pavlo:DSPIC33EP256MC50
U$2 U$9-U$12 = OpenPMSM:NETJUMPER
U$3-U$8 = pavlo:PSMN013-80YS
U$13 = SwitcherPowerStage:SLF12555T
U$14 U$19 = OpenPMSM:MICROCLASP3
U$15 = OpenPMSM:3M10PIN2500
U$16 = OpenPMSM:MINIFITJR4PIN
U$17 = OpenPMSM:MINIFITJR6PIN
U$18 = OpenPMSM:MICROCLASP2
U$20 = OpenPMSM:MICROCLASP5

## Net classes
2 small: width 0.254 mm, clearance 0.254 mm to class 1
3 Power: clearance 0.381 mm to class 0

## Board
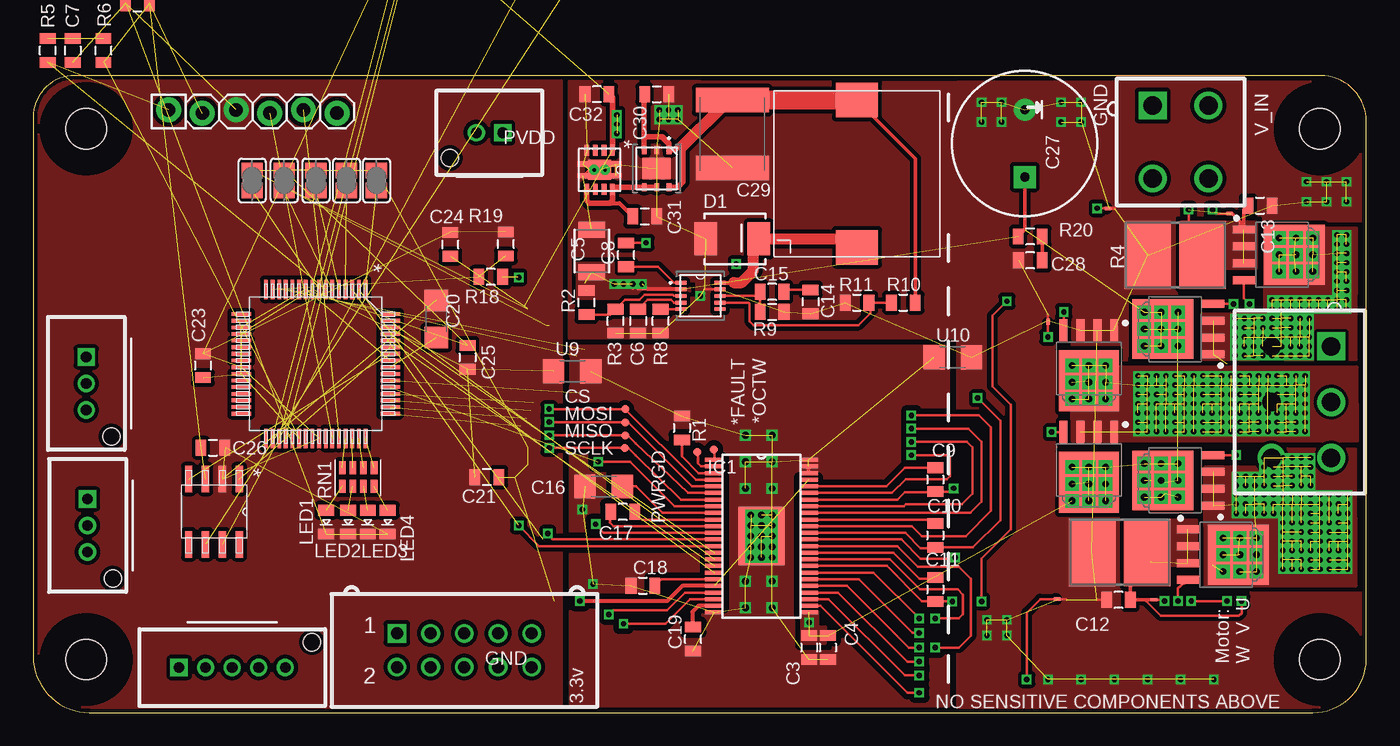
[diagram p6: board, top side]
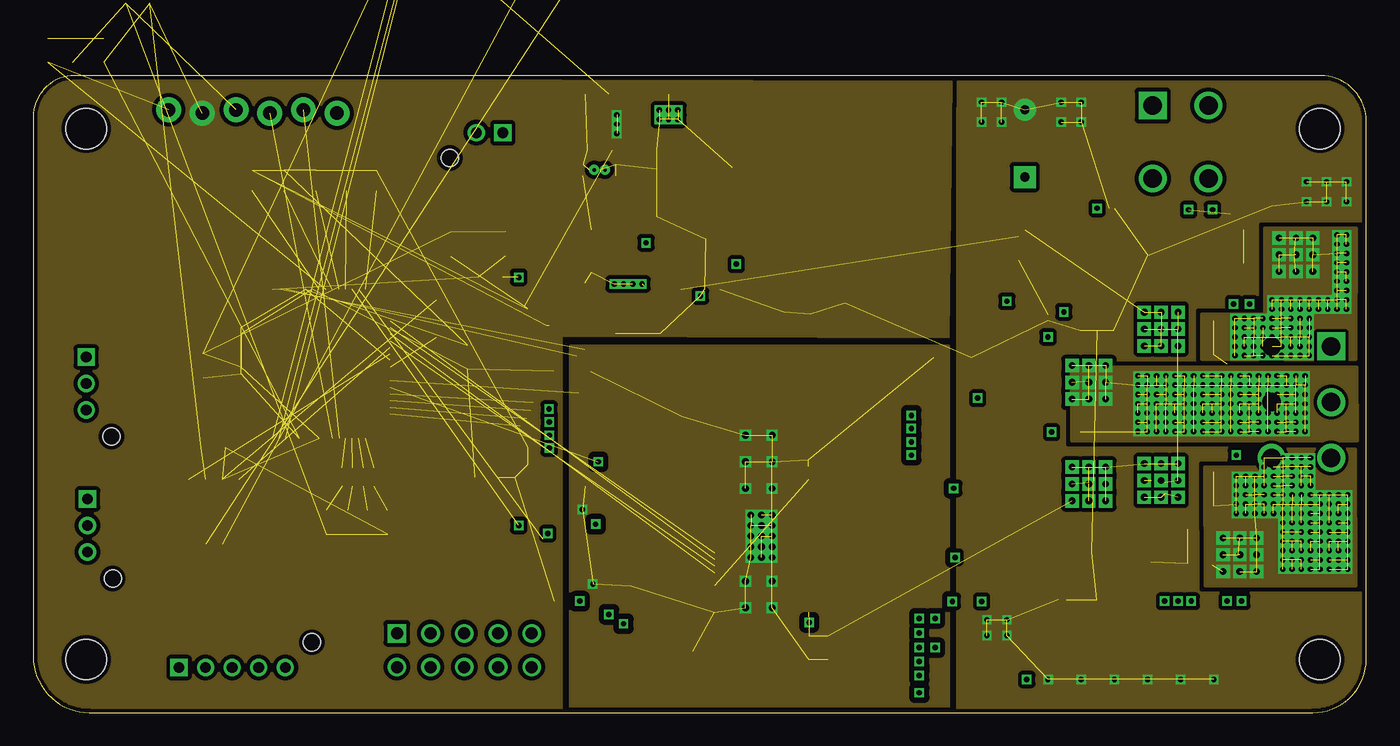
[diagram p7: board, inner layer Route2]
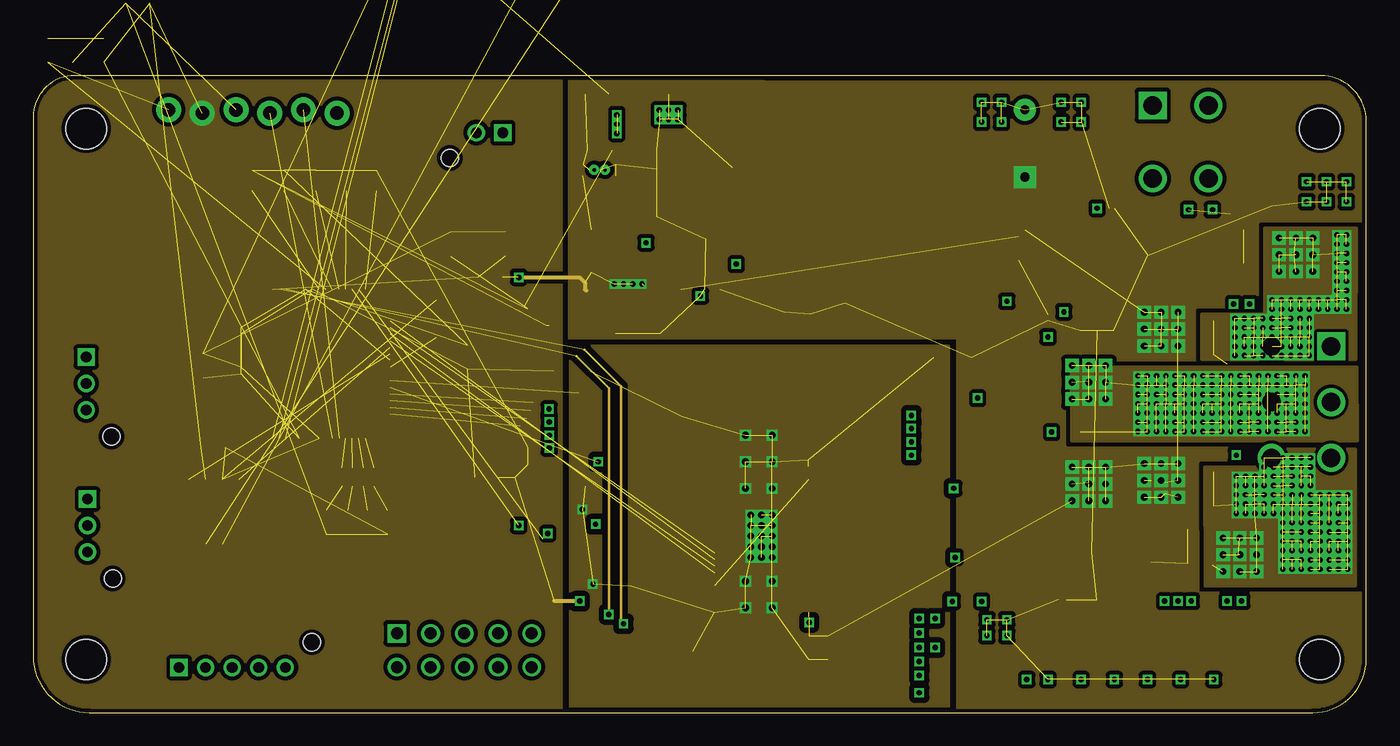
[diagram p8: board, inner layer Route15]
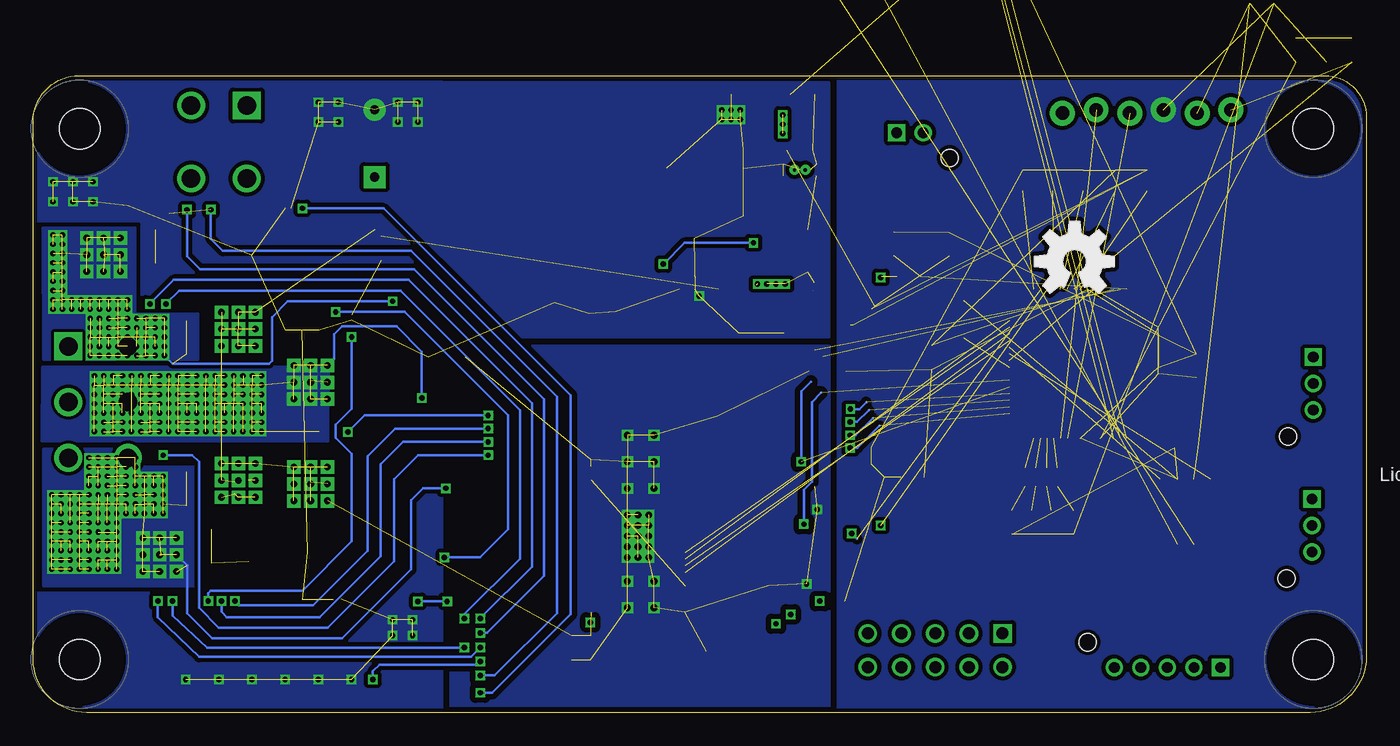
[diagram p9: board, bottom side, seen from below]

Size 100.5 x 48 mm. Coordinates in mm from the lower left corner, seen from the top.
Outline: 0,44.88 0,4.24 arc90 4.24,0 96.47,0 arc90 100.5,4.03 100.5,44.53 arc90 97.03,48 3.12,48 arc90 0,44.88
Copper layers (1*16): Top 0.035mm / dielectric 1.5mm / Bottom 0.035mm
Design rules "default": minimum track width 6mil, minimum drill 12mil, track to track 6mil, track to pad 6mil, pad to pad 6mil, via to via 6mil, smd to smd 0mil, copper to edge 10mil, drill to drill 10mil, minimum pad ring 10mil, minimum via ring 6mil, stop-mask expansion 2mil, vias tented up to drill 100mil, thermal gap 10mil

### Footprints (pad centres in the part's own frame; a part is rotated, then mirrored left to right if it is on the bottom)
0805 = smd 0.8 x 1.2: 1 -0.9,0; 2 0.9,0
1210 = smd 1.2 x 2: 1 -1.6,0; 2 1.6,0
1206 = smd 1.6 x 1.8: 1 -1.4,0; 2 1.4,0
CPOL-RADIAL-1000UF-25V = drill 0.7 pad 1.651 square: 1 2.54,0 | drill 0.7 pad 1.651: 2 -2.54,0
C2220K = smd 1.85 x 5.5: 1 -2.55,0; 2 2.55,0
SMA-DIODE-B240A = smd 1.7 x 2.5: A 0,0; C 4,0
STAND-OFF-TIGHT = hole 3.048: 0,0
HTSSOP-480-DCA = smd 1.4 x 0.3: 1 -3.55,5.75; 2 -3.55,5.25; 3 -3.55,4.75; 4 -3.55,4.25; 5 -3.55,3.75; 6 -3.55,3.25; 7 -3.55,2.75; 8 -3.55,2.25; 9 -3.55,1.75; 10 -3.55,1.25; 11 -3.55,0.75; 12 -3.55,0.25; 13 -3.55,-0.25; 14 -3.55,-0.75; 15 -3.55,-1.25; 16 -3.55,-1.75; 17 -3.55,-2.25; 18 -3.55,-2.75; 19 -3.55,-3.25; 20 -3.55,-3.75; 21 -3.55,-4.25; 22 -3.55,-4.75; 23 -3.55,-5.25; 24 -3.55,-5.75; 25 3.55,-5.75; 26 3.55,-5.25; 27 3.55,-4.75; 28 3.55,-4.25; 29 3.55,-3.75; 30 3.55,-3.25; 31 3.55,-2.75; 32 3.55,-2.25; 33 3.55,-1.75; 34 3.55,-1.25; 35 3.55,-0.75; 36 3.55,-0.25; 37 3.55,0.25; 38 3.55,0.75; 39 3.55,1.25; 40 3.55,1.75; 41 3.55,2.25; 42 3.55,2.75; 43 3.55,3.25; 44 3.55,3.75; 45 3.55,4.25; 46 3.55,4.75; 47 3.55,5.25; 48 3.55,5.75 | smd 3.48 x 4.42: 49 0,0
1X06_LOCK = drill 1.016 pad 1.88: 1 0,0.127; 2 2.54,-0.127; 3 5.08,0.127; 4 7.62,-0.127; 5 10.16,0.127; 6 12.7,-0.127
LED-0805 = smd 0.8 x 1.2: 1 -0.9,0; 2 0.9,0
SMT-REF = smd 3.505 x 5.08: 1 2.134,0; 2 -2.007,0
EXB-38V271JV = smd 0.5 x 1: P$1 0,0; P$2 0.8,0; P$3 1.6,0; P$4 2.4,0; P$5 2.4,1.4; P$6 1.6,1.4; P$7 0.8,1.4; P$8 0,1.4
SJ = smd 1.168 x 1.6: 1 -0.762,0; 2 0.762,0
TP06R = smd 0.6 x 0.6: TP 0,0
DRB8_1P75X1P5 = smd 0.838 x 0.356: 1 -1.473,0.965; 2 -1.473,0.33; 3 -1.473,-0.33; 4 -1.473,-0.965; 5 1.473,-0.965; 6 1.473,-0.33; 7 1.473,0.33; 8 1.473,0.965 | smd 1.499 x 1.753: 9 0,0 | smd 0.4 x 0.8: P$1 -0.44,1.25; P$2 0.44,1.25; P$3 -0.44,-1.25; P$4 0.44,-1.25 | drill 0.254: V 0,-0.406; V_2 0,0.406
D8 = smd 1.981 x 0.559: 1 -2.464,1.905; 2 -2.464,0.635; 3 -2.464,-0.635; 4 -2.464,-1.905; 5 2.464,-1.905; 6 2.464,-0.635; 7 2.464,0.635; 8 2.464,1.905
PW16 = smd 1.676 x 0.356: 1 -2.819,2.286; 2 -2.819,1.626; 3 -2.819,0.965; 4 -2.819,0.33; 5 -2.819,-0.33; 6 -2.819,-0.965; 7 -2.819,-1.626; 8 -2.819,-2.286; 9 2.819,-2.286; 10 2.819,-1.626; 11 2.819,-0.965; 12 2.819,-0.33; 13 2.819,0.33; 14 2.819,0.965; 15 2.819,1.626; 16 2.819,2.286
DRC10_2P4X1P65 = smd 0.838 x 0.279: 1 -1.473,0.991; 2 -1.473,0.508; 3 -1.473,0; 4 -1.473,-0.508; 5 -1.473,-0.991; 6 1.473,-0.991; 7 1.473,-0.508; 8 1.473,0; 9 1.473,0.508; 10 1.473,0.991
SDE06A = smd 0.61 x 0.356: 1 -1.397,0.94; 2 -1.397,0; 3 -1.397,-0.94; 4 1.397,-0.94; 5 1.397,0; 6 1.397,0.94 | smd 1.6 x 2.108: 7 0,0
QFP64-10X10MC = smd 1.473 x 0.279: 1 -5.613,3.759; 2 -5.613,3.251; 3 -5.613,2.743; 4 -5.613,2.261; 5 -5.613,1.753; 6 -5.613,1.245; 7 -5.613,0.762; 8 -5.613,0.254; 9 -5.613,-0.254; 10 -5.613,-0.762; 11 -5.613,-1.245; 12 -5.613,-1.753; 13 -5.613,-2.261; 14 -5.613,-2.743; 15 -5.613,-3.251; 16 -5.613,-3.759; 33 5.613,-3.759; 34 5.613,-3.251; 35 5.613,-2.743; 36 5.613,-2.261; 37 5.613,-1.753; 38 5.613,-1.245; 39 5.613,-0.762; 40 5.613,-0.254; 41 5.613,0.254; 42 5.613,0.762; 43 5.613,1.245; 44 5.613,1.753; 45 5.613,2.261; 46 5.613,2.743; 47 5.613,3.251; 48 5.613,3.759 | smd 0.279 x 1.473: 17 -3.759,-5.613; 18 -3.251,-5.613; 19 -2.743,-5.613; 20 -2.261,-5.613; 21 -1.753,-5.613; 22 -1.245,-5.613; 23 -0.762,-5.613; 24 -0.254,-5.613; 25 0.254,-5.613; 26 0.762,-5.613; 27 1.245,-5.613; 28 1.753,-5.613; 29 2.261,-5.613; 30 2.743,-5.613; 31 3.251,-5.613; 32 3.759,-5.613; 49 3.759,5.613; 50 3.251,5.613; 51 2.743,5.613; 52 2.261,5.613; 53 1.753,5.613; 54 1.245,5.613; 55 0.762,5.613; 56 0.254,5.613; 57 -0.254,5.613; 58 -0.762,5.613; 59 -1.245,5.613; 60 -1.753,5.613; 61 -2.261,5.613; 62 -2.743,5.613; 63 -3.251,5.613; 64 -3.759,5.613
NETJUMPER = smd 0.254 x 0.254: P$1 -0.1,0; P$2 0.1,0
TO127P600X120-5N = smd 1.65 x 0.6: 1 -2.65,1.905; 2 -2.65,0.635; 3 -2.65,-0.635; 4 -2.65,-1.905 | smd 4.6 x 4.5: 5 1.15,0 | drill 0.5 square: P$1 0,1.27; P$2 1.27,1.27; P$3 2.54,1.27; P$4 2.54,0; P$5 1.27,0; P$6 0,0; P$7 0,-1.27; P$8 1.27,-1.27; P$9 2.54,-1.27
SLF12555 = smd 2.6 x 3.2: P$1 -5.55,0; P$2 5.55,0
55932-0310 = drill 0.8: P$1 0,0; P$3 2,0 | drill 0.8 square: P$2 -2,0 | hole 1.3: 4,1.9
FOUR-WALL-2500-LP-STH = drill 0.9 square: 1 -5.08,1.27 | drill 0.9: 2 -5.08,-1.27; 3 -2.54,1.27; 4 -2.54,-1.27; 5 0,1.27; 6 0,-1.27; 7 2.54,1.27; 8 2.54,-1.27; 9 5.08,1.27; 10 5.08,-1.27
0039288040 = drill 1.4 square: 1 -2.1,2.75 | drill 1.4: 2 2.1,2.75; 3 -2.1,-2.75; 4 2.1,-2.75
0039288060 = drill 1.4 square: 1 -4.2,2.25 | drill 1.4: 2 -4.2,-2.25; 3 0,2.25; 4 0,-2.25; 5 4.2,2.25; 6 4.2,-2.25
55932-0210 = drill 0.8 square: 1 -1,0 | drill 0.8: 2 1,0 | hole 1.3: 3,1.9
55932-0510 = drill 0.8 square: 1 -4,0 | drill 0.8: 2 -2,0; 3 0,0; 4 2,0; 5 4,0 | hole 1.3: 6,1.9

### Placement (x,y rotation side)
C3  58.5,4.9 270 top
C4  59.9,4.9 270 top
C5  42.1,34.8 90 top
C6  45.6,29.5 270 top
C7  2.98,49.9 270 top
C8  44.7,34.5 90 top
C9  68,17.55 270 top
C10  68,13.35 270 top
C11  68,9.28 270 top
C12  81.81,8.5 180 top
C13  92.48,38.2 0 top
C14  58.6,30.96 270 top
C15  55.7,30.2 0 top
C16  43.01,17.04 180 top
C17  44.44,15.12 180 top
C18  45.97,9.57 0 top
C19  49.75,5.54 90 top
C20  30.39,29.66 90 top
C21  34.2,17.74 180 top
C22  7.87,53.44 0 top  (outside the outline)
C23  12.8,26.14 270 top
C24  31.45,35.29 90 top
C25  32.74,26.77 270 top
C26  13.56,19.96 0 top
C27  74.75,42.89 270 top
C28  75.17,34.08 180 top
C29  52.7,43.6 270 top
C30  47,46.6 0 top
C31  46.1,37.4 0 top
C32  42.5,46.6 180 top
D1  50.7,35.7 0 top
E$1  [STAND-OFF-TIGHT]  4,44 0 top
E$2  [STAND-OFF-TIGHT]  4,4 0 top
E$3  [STAND-OFF-TIGHT]  97,4 0 top
E$4  [STAND-OFF-TIGHT]  97,44 0 top
IC1  54.9,13.3 0 top
JP3  10.21,45.3 0 top
LED1  22.1,14.35 270 top
LED2  23.73,14.35 270 top
LED3  25.23,14.35 270 top
LED4  26.73,14.35 270 top
R1  48.9,21.45 270 top
R2  41.7,30.9 90 top
R3  43.9,29.5 90 top
R4  86.16,34.47 180 top
R5  1.1,49.9 90 top
R6  5.3,49.9 90 top
R7  81.96,12.07 180 top
R8  47.3,29.5 90 top
R9  55.7,31.7 180 top
R10  65.6,30.9 0 top
R11  62.1,30.9 0 top
R17  39.13,59.85 270 top  (outside the outline)
R18  34.49,32.83 180 top
R19  35.63,35.32 90 top
R20  75.16,35.88 180 top
RN1  25.7,18.45 180 top
SJ1  25.88,40.1 270 top
SJ4  23.62,40.1 270 top
SJ5  21.32,40.1 270 top
SJ6  18.92,40.1 270 top
SJ7  16.5,40.1 270 top
SJ8  43.51,60.82 0 top  (outside the outline)
TP1  44.63,22.87 0 top
TP2  44.62,21.87 0 top
TP3  44.62,20.9 0 top
TP4  44.6,19.95 0 top
TP6  51.32,19.83 90 top
TP7  50.06,19.65 270 top
U1  42.7,40.9 270 top
U2  13.63,15.14 270 top
U3  31.83,61.45 180 top  (outside the outline)
U4  50.3,31.4 0 top
U5  47,41 270 top
U9  40.63,25.73 0 top
U10  69.32,26.77 0 top
U$1  21.3,26.28 270 top
U$2  77.19,8.55 0 top
U$3  86.3,17.5 180 top
U$4  79.58,18.5 270 top
U$5  86.3,28.9 180 top
U$6  89.69,11.9 0 top
U$7  79.58,26.16 270 top
U$8  93.92,34.5 0 top
U$9  84.5,8.5 0 top
U$10  76.5,29.45 90 top
U$11  81,38 0 top
U$12  90.16,37.6 180 top
U$13  62.1,40.6 90 top
U$14  4.1,14.1 270 top
U$15  32.5,4.7 0 top
U$16  86.5,43 0 top
U$17  95.6,23.4 270 top
U$18  34.4,43.7 180 top
U$19  4,24.8 270 top
U$20  15,3.4 0 top

### Tracks (layer width: path | path; a pad name or v marks a point on that pad's centre or on a via)
*SCS  (via drill 0.4)  (1 unrouted)
  Top 0.203: IC1.4 49.95,17.55 TP1.TP v38.89,22.87
  Bottom 0.203: v38.89,22.87 38.23,22.87 37.7,23.4
BST_B
  Top 0.203: IC1.39 67.59,14.55 C10.1
BST_C
  Top 0.203: IC1.34 64.85,12.05 66.8,10.1 67.92,10.1 C11.1
CAN_H  (1 unrouted)
CAN_L  (1 unrouted)
CANRX  (1 unrouted)
CANTX  (1 unrouted)
CRNT1  (via drill 0.4)  (1 unrouted)
  Top 0.203: IC1.21 49.15,9.05 47.8,7.7 43.7,7.7 v43.4,7.4
  Route15 0.203: v43.4,7.4 43.4,24.43 40.96,26.87
CRNT2  (via drill 0.4)  (1 unrouted)
  Top 0.203: v44.5,6.7 47.67,6.7 49.52,8.55 IC1.22
  Route15 0.203: 41.56,27.34 44.3,24.6 44.3,6.9 v44.5,6.7
DC_CAL  (via drill 0.4)  (1 unrouted)
  Top 0.203: IC1.8 48.35,15.55 45,18.9 v42.6,18.9
  Bottom 0.203: 41.88,24.92 42.6,24.2 v42.6,18.9
DRV_GND  (via drill 0.4, 0.5)  (37 unrouted)
  Top 0.254: IC1.46 IC1.47
  other vias: 54.9,13.3 55.7,13.3 55.7,12.5 54.9,12.5 54.1,12.5 54.1,13.3 54.1,14.1 54.9,14.1 55.7,14.1 54.1,14.9 54.9,14.9 55.7,14.9 55.7,11.7 54.9,11.7 54.1,11.7 55.7,16.9 53.7,16.9 53.7,18.9 55.7,18.9 55.7,9.9 53.7,9.9 55.7,7.9 53.7,7.9 55.7,20.9 53.7,20.9 41.4,15.3 42.2,9.7
  pour Top (isolate 0.406, rank 4, no thermals): 40.5,0 69,0 69,27.6 40.5,27.63
  pour Bottom (isolate 0.406, rank 4): 40.5,0 69,0 69,27.6 40.5,27.6
  pour Route2 (isolate 0.406, rank 4): 40.5,0 69,0 69,27.6 40.5,27.6
  pour Route15 (isolate 0.406, rank 4): 40.5,0 69,0 69,27.6 40.5,27.6
EN_A  (1 unrouted)
EN_B  (1 unrouted)
EN_C  (1 unrouted)
EN_GATE  (via drill 0.4)  (1 unrouted)
  Top 0.203: IC1.12 43,13.55 42.4,14.15 v42.4,14.2
  Bottom 0.203: 41.1,24.1 41.8,23.4 41.8,17.4 42.4,16.8 v42.4,14.2
GH_A  (via drill 0.4)
  Top 0.203: IC1.43 64.75,16.55 65.8,17.6 68.9,17.6 69.1,17.8 69.1,19.2 68.9,19.4 v66.2,19.4 | U$3.4 v90.69,19.41 v90.7,19.4
  Bottom 0.203: v90.7,19.4 88.5,19.4 88,18.9 88,7.9 86.5,6.4 78.3,6.4 73.3,11.4 73.3,17.6 71.5,19.4 v66.2,19.4
GH_B  (via drill 0.4)
  Top 0.203: IC1.38 66.25,14.05 67,13.3 70.3,13.3 72.2,15.2 72.2,21.5 71.3,22.4 v66.2,22.4 | v76.78,21.14 U$4.4
  Top 0.254: U$4.4 77.67,21.12 77.7,21.1
  Bottom 0.203: v66.2,22.4 75.52,22.4 v76.78,21.14
GH_C  (via drill 0.4)
  Top 0.203: IC1.33 64.58,11.55 66.85,9.28 69.72,9.28 70.1,8.9 70.1,7.4 69.8,7.1 v68,7.1 | v90.5,30.8 U$5.4
  Bottom 0.203: v68,7.1 68,7.4 63.8,11.6 63.8,22.8 72.8,31.8 89.5,31.8 v90.5,30.8
GL_A  (via drill 0.4)
  Top 0.203: IC1.41 65.65,15.55 65.8,15.7 70,15.7 70.8,16.5 70.8,20 70.4,20.4 v66.2,20.4 | 86.9,9.86 U$6.4 | 86.8,9.76 U$6.4 | v86.3,8.4 86.3,9.36 U$6.4
  Bottom 0.203: v86.3,8.4 86.3,7.6 85.9,7.2 78.9,7.2 74.3,11.8 74.3,18.7 72.6,20.4 v66.2,20.4
GL_B  (via drill 0.4)
  Top 0.203: IC1.36 65.45,13.05 66.9,11.6 69.1,11.6 v69.5,11.7 | v77.7,30.2 77.7,28.84 U$7.4
  Bottom 0.203: v69.5,11.7 66.8,11.7 64.7,13.8 64.7,22.4 72.5,30.2 v77.7,30.2
GL_C  (via drill 0.4)
  Top 0.203: IC1.31 63.35,10.55 v66.8,7.1 | v91.7,30.8 91.27,31.23 U$8.4
  Bottom 0.203: v66.8,7.1 62.9,11 62.9,23.3 72.2,32.6 89.9,32.6 v91.7,30.8
GND  (21 unrouted)
  pour Top (isolate 0.305, no thermals): 0,47.6 39.8,47.6 39.8,0 0,0
  pour Bottom (isolate 0.305, rank 2, no thermals): 0,47.6 39.8,47.6 39.8,0 0,0
MCLR  (2 unrouted)
MISO  (via drill 0.4)  (1 unrouted)
  Top 0.203: IC1.6 49.35,16.55 45.4,20.3 44.8,20.9 TP3.TP v38.9,20.9
  Bottom 0.203: v38.9,20.9 38.5,20.9 37.2,22.2
MOSI  (via drill 0.4)  (1 unrouted)
  Top 0.203: IC1.5 49.65,17.05 44.83,21.87 TP2.TP 38.93,21.87 v38.9,21.9
  Bottom 0.203: v38.9,21.9 38.4,21.9 37.5,22.8
N$1
  Top 0.203: IC1.3 50.15,18.05 48.9,19.3 R1.2
N$2  (2 unrouted)
N$3
  Bottom 0.2: 22.79,32.09 arc9 23.09,32.25 23.85,31.64 24.36,32.15 23.75,32.91 arc19 24.01,33.54 24.98,33.63 24.98,34.37 24.01,34.46 arc19 23.75,35.09 24.36,35.85 23.85,36.36 23.09,35.75 arc19 22.46,36.01 22.37,36.98 21.63,36.98 21.54,36.01 arc19 20.91,35.75 20.15,36.36 19.64,35.85 20.25,35.09 arc19 19.99,34.46 19.02,34.37 19.02,33.63 19.99,33.54 arc19 20.25,32.91 19.64,32.15 20.15,31.64 20.91,32.25 arc9 21.21,32.09 21.64,33.13 arc-68 21.06,34 arc-248 22.36,33.13 22.79,32.09
N$4
  Top 0.203: IC1.44 64.34,17.05 65.73,18.44 C9.1
N$5  (1 unrouted)
N$6
  Top 0.254: R20.1 C28.1
N$7
  Top 0.203: U4.3 48.3,31.4 48.2,31.5 46.1,31.5 45.7,31.1 44.6,31.1 R3.2 43.5,30 R2.1
N$8
  Top 0.203: U4.4 48.31,30.89 48.1,31.1 46.3,31.1 C6.1
N$9
  Top 0.203: U4.5 R8.2
N$10
  Top 0.203: U4.1 48.31,32.39 47.1,33.6 C8.1
N$12
  Top 0.203: IC1.1 51.35,19.8 TP6.TP
N$13  (via drill 0.4)
  Top 0.203: C8.2 v46.2,35.4 | v53,33.8 53.8,33.8 54.6,34.6 54.6,35.6 D1.C
  Top 0.305: U4.10 52.59,32.39 52.6,32.4 52.8,32.4
  Top 0.813: 52.8,32.4 53.4,32.4 54.3,33.3 54.3,35.3 D1.C 61.9,35.7 62,35.6 62,35.15 U$13.P$1
  Bottom 0.203: v46.2,35.4 51.4,35.4 v53,33.8
N$14
  Top 0.203: U4.8 54.7,31.4 R9.2 C15.1
N$15
  Top 0.203: C14.1 56.66,31.86 R9.1
N$16
  Top 0.203: U4.7 53.91,30.89 54,30.8 54,29.5 54.3,29.2 62.2,29.2 63.1,30.1 63.1,31 R11.2 | 63,30.8 R11.2 | R11.2 R10.1
N$18
  Top 0.203: IC1.9 47.45,15.05 45.46,17.04 C16.1
N$19
  Top 0.203: IC1.10 45.91,14.55 C17.1
N$20
  Top 0.203: IC1.11 43.75,14.05 43.5,14.3 43.5,15.08 C17.2
N$21
  Top 0.203: IC1.19 47.35,10.05 C18.2
N$22
  Top 0.305: IC1.23 50.15,8.05 49.7,7.6 49.7,6.49 C19.2
N$24
  Top 0.203: IC1.2 50.35,18.55 50.1,18.8 50.1,19.61 TP7.TP
N$25  (2 unrouted)
N$27  (1 unrouted)
N$28  (1 unrouted)
N$29  (1 unrouted)
N$30  (1 unrouted)
N$31  (1 unrouted)
N$33  (1 unrouted)
N$41  (1 unrouted)
N$42  (1 unrouted)
N$43  (1 unrouted)
N$44  (1 unrouted)
N$45  (1 unrouted)
N$46  (1 unrouted)
N$47  (1 unrouted)
N$64  (1 unrouted)
PGC  (1 unrouted)
PGD  (1 unrouted)
PGND  (via drill 0.4)  (63 unrouted)
  Top 0.203: U4.9 50.61,31.91 50.6,31.9 | U1.9 41.89,40.9 U1.P$4 | U$2.P$2 77.85,8.55 77.9,8.5 | U$10.P$2 76.5,30 | C12.2 80.2,8.5
  Top 0.254: U$11.P$2 81.5,38
  other vias: 76.5,2.5 79,2.5 81.5,2.5 84,2.5 86.5,2.5 89,2.5 71.5,46 77.5,46 77.5,44.5 79,44.5 79,46 73,46 73,44.5 71.5,44.5 99,40 97.5,40 96,40 96,38.5 97.5,38.5 99,38.5 50.3,31.4 47.2,44.7 47.9,44.7 48.6,44.7 48.6,45.4 47.9,45.4 47.2,45.4 71.9,7 73.4,7 73.4,5.8 71.9,5.8
  pour Top (isolate 0.305, rank 4, no thermals): 69.7,47.5 100.5,47.5 100.5,0.1 69.7,0.1
  pour Bottom (isolate 0.305, rank 4, no thermals): 69.7,47.5 100.5,47.5 100.5,0.1 69.7,0.1
  pour Route2 (isolate 0.305, rank 4, no thermals): 69.7,47.5 100.5,47.5 100.5,0.1 69.7,0.1
  pour Top (isolate 0.305, rank 3, no thermals): 40.4,47.6 40.4,28.2 70.17,28.2 70.18,47.52
  pour Bottom (isolate 0.305, rank 3, no thermals): 40.5,47.5 40.5,28.3 70,28.3 70.08,47.54
PVDD  (via drill 0.4)  (38 unrouted)
  Top 0.203: U4.2 45.59,31.91 v45.2,32.3
  Top 0.254: U$5.P$5 U$5.5 | U$3.P$5 84.3,17.5 85.3,16.5 85.3,17.35 U$3.5 | U$4.5 U$4.P$5 U$4.P$9 | R20.2 74.75,36.37 C27.1
  Top 0.305: 36.57,32.83 v36.6,32.8 | U4.2 46.29,31.91 46,32.2 45.4,32.2 45.2,32
  Route15 0.305: v36.6,32.8 41.2,32.8 41.6,32.4 41.6,31.9 R2.2
  other vias: 45.9,32.3 44.5,32.3 43.8,32.3 58.5,6.8
  pour Top (rank 2, no thermals): 59.71,6.42 59.13,6.42 59.13,7.59 57.96,7.6 57.95,7.61 57.95,5.34 58.05,5.24 59.65,5.23 59.7,5.23
  pour Route15 (isolate 0.305, rank 4, no thermals): 69.7,47.5 100.5,47.5 100.5,0.1 69.7,0.1
  pour Top (isolate 0.254, rank 2, no thermals): 41,33.9 41,31.2 49.5,31.2 49.5,32.7 47.5,32.7 47.5,33.9
  pour Route15 (isolate 0.305, rank 4): 69.9,47.53 40.4,47.6 40.4,28.2 69.9,28.2
PWM1H  (via drill 0.4)  (1 unrouted)
  Top 0.203: IC1.13 39.15,13.05 v38.8,13.5
  Bottom 0.203: 38.4,13.1 v38.8,13.5
PWM1L  (via drill 0.4)  (1 unrouted)
  Top 0.203: IC1.14 38.15,12.55 v36.6,14.1
PWM2H  (1 unrouted)
PWM2L  (1 unrouted)
PWM3H  (1 unrouted)
PWM3L  (1 unrouted)
SCLK  (via drill 0.4)  (1 unrouted)
  Top 0.203: IC1.7 48.85,16.05 45.4,19.4 44.85,19.95 TP4.TP v38.9,19.95
  Bottom 0.203: v38.9,19.95 38.35,19.95 36.7,21.6
SH_A  (via drill 0.4, 0.4 pad 0.25)  (129 unrouted)
  Top 0.203: IC1.42 65.15,16.05 65.7,16.6 67.95,16.6 C9.2 69.15,16.65 v69.4,16.9
  Bottom 0.203: v69.4,16.9 71.1,16.9 72,16 72,10.8 77.2,5.6 87,5.6 88.9,7.5 88.9,11.11 U$6.P$6
  other vias: 90.7,17.81 90.7,15.71 90.7,17.11 90.7,16.41 91.4,17.81 91.4,17.11 91.4,16.41 91.4,15.71 91.4,15.01 92.1,15.01 92.1,15.71 92.1,16.41 92.1,17.11 92.1,17.81 97,16.41 97.7,16.41 98.4,16.41 99.1,16.41 99.1,15.71 98.4,15.71 97.7,15.71 97,15.71 97,15.01 97.7,15.01 98.4,15.01 99.1,15.01 99.1,14.31 98.4,14.31 98.4,13.61 99.1,13.61 98.4,12.91 99.1,12.91 98.4,12.21 99.1,12.21 98.4,11.51 99.1,11.51 98.4,10.81 99.1,10.81 92.8,18.51 92.8,19.21 93.5,19.21 93.5,18.51 94.2,19.21 94.2,18.51 94.9,19.21 94.9,18.51 95.6,18.51 95.6,19.21 92.8,17.81 92.8,15.01 92.8,15.71 92.8,17.11 92.8,16.41 93.5,17.81 93.5,17.11 93.5,16.41 93.5,15.71 93.5,15.01 94.2,15.01 94.2,15.71 94.2,16.41 94.2,17.11 94.2,17.81 94.9,17.81 94.9,15.01 94.9,15.71 94.9,17.11 94.9,16.41 95.6,17.81 95.6,17.11 95.6,16.41 95.6,15.71 95.6,15.01 96.3,15.01 96.3,15.71 96.3,16.41 96.3,17.11 96.3,17.81 94.2,14.31 94.2,11.51 94.2,12.21 94.2,13.61 94.2,12.91 94.9,14.31 94.9,13.61 94.9,12.91 94.9,12.21 94.9,11.51 95.6,11.51 95.6,12.21 95.6,12.91 95.6,13.61 95.6,14.31 94.2,10.81 94.9,10.81 95.6,10.81 96.3,14.31 96.3,11.51 96.3,12.21 96.3,13.61 96.3,12.91 97,14.31 97,13.61 97,12.91 97,12.21 97,11.51 97.7,11.51 97.7,12.21 97.7,12.91 97.7,13.61 97.7,14.31 96.3,10.81 97,10.81 97.7,10.81 96.3,18.51 96.3,19.21 90.7,15.01
  pour Route2 (isolate 0.254): 88.33,18.49 92.12,18.5 92.12,19.84 99.67,19.84 99.69,9.56 88.35,9.55
  pour Bottom (isolate 0.254): 88.34,18.49 92.12,18.5 92.14,19.84 99.69,19.84 99.69,9.56 88.36,9.55
  pour Top (isolate 0.254): 88.32,18.49 92.12,18.5 92.13,19.84 99.68,19.84 99.7,9.56 88.35,9.55
  pour Route15 (isolate 0.254): 88.34,18.48 92.12,18.5 92.12,19.84 99.67,19.84 99.68,9.55 88.35,9.53
SH_B  (via drill 0.4, 0.4 pad 0.25)  (145 unrouted)
  Top 0.203: IC1.37 65.75,13.55 66.9,12.4 67.94,12.4 C10.2 70.85,12.45 72.9,14.5 72.9,22 v71.2,23.7
  Bottom 0.203: v71.2,23.7 71.2,27.2 73.1,29.1 77.2,29.1 77.8,28.5 77.8,26.67 U$7.P$7
  other vias: 83.98,24.68 84.68,24.68 85.38,24.68 83.28,23.28 84.68,23.98 83.98,23.98 85.38,23.98 83.28,25.38 84.68,23.28 85.38,23.28 83.98,23.28 83.28,21.18 83.28,24.68 83.28,21.88 83.28,22.58 83.98,25.38 84.68,25.38 85.38,25.38 85.38,22.58 84.68,22.58 83.98,22.58 83.98,21.88 84.68,21.88 85.38,21.88 85.38,21.18 84.68,21.18 83.98,21.18 89.58,24.68 90.28,24.68 90.98,24.68 88.88,23.28 90.28,23.98 89.58,23.98 90.98,23.98 88.88,25.38 90.28,23.28 90.98,23.28 89.58,23.28 88.88,21.18 88.88,24.68 88.88,23.98 88.88,21.88 88.88,22.58 89.58,25.38 90.28,25.38 90.98,25.38 90.98,22.58 90.28,22.58 89.58,22.58 89.58,21.88 90.28,21.88 90.98,21.88 90.98,21.18 90.28,21.18 89.58,21.18 86.78,24.68 87.48,24.68 88.18,24.68 86.08,23.28 87.48,23.98 86.78,23.98 88.18,23.98 86.08,25.38 87.48,23.28 88.18,23.28 86.78,23.28 86.08,21.18 86.08,24.68 86.08,23.98 86.08,21.88 86.08,22.58 86.78,25.38 87.48,25.38 88.18,25.38 88.18,22.58 87.48,22.58 86.78,22.58 86.78,21.88 87.48,21.88 88.18,21.88 88.18,21.18 87.48,21.18 86.78,21.18 92.38,24.68 93.08,24.68 93.78,24.68 91.68,23.28 93.08,23.98 92.38,23.98 93.78,23.98 91.68,25.38 93.08,23.28 93.78,23.28 92.38,23.28 91.68,21.18 91.68,24.68 91.68,23.98 91.68,21.88 91.68,22.58 92.38,25.38 93.08,25.38 93.78,25.38 93.78,22.58 93.08,22.58 92.38,22.58 92.38,21.88 93.08,21.88 93.78,21.88 93.78,21.18 93.08,21.18 92.38,21.18 95.18,24.68 95.88,24.68 94.48,23.28 95.88,23.98 95.18,23.98 94.48,25.38 95.88,23.28 95.18,23.28 94.48,21.18 94.48,24.68 94.48,23.98 94.48,21.88 94.48,22.58 95.18,25.38 95.88,25.38 95.88,22.58 95.18,22.58 95.18,21.88 95.88,21.88 95.88,21.18 95.18,21.18 83.28,23.98
  pour Top (isolate 0.254): 78.27,26.03 99.77,26.03 99.8,20.5 78.3,20.5
  pour Bottom (isolate 0.254): 78.27,26.03 99.77,26.03 99.8,20.5 78.3,20.5
  pour Route2 (isolate 0.254): 78.27,26.03 99.77,26.03 99.8,20.5 78.3,20.5
  pour Route15 (isolate 0.254): 78.27,26.03 99.77,26.03 99.8,20.5 78.3,20.5
SH_C  (via drill 0.4)  (89 unrouted)
  Top 0.203: IC1.32 64.35,11.05 67,8.4 67.98,8.4 C11.2 v69.29,8.38 | v71.5,8.38 71.5,11.6 73.7,13.8 73.7,23.2 72.3,24.6 72.3,29.9 v73.4,31
  Bottom 0.203: v69.29,8.38 v71.5,8.38 | v73.4,31 81.3,31 82.5,29.8 82.5,26.5 82.7,26.3 90,26.3 v90.6,26.9
  other vias: 90.6,27.6 90.6,28.3 90.6,29 90.6,29.7 91.3,29.7 91.3,29 91.3,28.3 91.3,27.6 91.3,26.9 92,29.7 92,29 92,28.3 92,27.6 92,26.9 92.7,27.6 92.7,28.3 92.7,29 92.7,29.7 92.7,26.9 93.4,26.9 94.1,26.9 94.8,26.9 95.5,26.9 96.2,26.9 96.2,27.6 95.5,27.6 94.8,27.6 94.1,27.6 93.4,27.6 93.4,28.3 93.4,29 93.4,29.7 94.1,29.7 94.1,29 94.1,28.3 94.8,28.3 95.5,28.3 96.2,28.3 94.8,29 95.5,29 96.2,29 94.8,29.7 95.5,29.7 96.2,29.7 93.4,30.4 93.4,31.1 94.1,31.1 94.1,30.4 94.8,30.4 94.8,31.1 95.5,31.1 95.5,30.4 96.2,31.1 96.2,30.4 96.9,30.4 97.6,30.4 98.3,30.4 99,30.4 96.9,31.1 97.6,31.1 98.3,31.1 99,31.1 98.3,31.8 99,31.8 98.3,32.5 99,32.5 98.3,33.2 98.3,33.9 98.3,34.6 98.3,35.3 98.3,36 99,36 99,35.3 99,34.6 99,33.9 99,33.2
  pour Top (isolate 0.254): 88.09,30.01 92.86,30.01 92.85,36.49 99.75,36.51 99.72,26.6 88.09,26.61
  pour Bottom (isolate 0.254): 88.09,30.01 92.86,30.01 92.85,36.49 99.75,36.51 99.72,26.61 88.09,26.62
  pour Route2 (isolate 0.254): 88.09,30.01 92.86,30.01 92.85,36.49 99.75,36.51 99.72,26.61 88.09,26.62
  pour Route15 (isolate 0.254): 88.09,30.01 92.86,30.01 92.85,36.49 99.75,36.51 99.72,26.61 88.08,26.61
SL_A  (via drill 0.4)
  Top 0.203: IC1.40 70.65,15.05 71.5,15.9 71.5,20.4 70.5,21.4 v66.2,21.4 | U$9.P$2 85.2,8.5 v85.3,8.4
  Bottom 0.203: v85.3,8.4 85,8.1 79.4,8.1 75.3,12.2 75.3,19.3 73.2,21.4 v66.2,21.4
SL_B  (via drill 0.4)
  Top 0.203: IC1.35 65.15,12.55 66.7,11 69.8,11 70.7,10.1 70.7,5.8 69.8,4.9 v68,4.9 | v90,8.4 v87.3,8.4 | v76.5,28.3 U$10.P$1
  Bottom 0.203: v68,4.9 87.4,4.9 90,7.3 v90,8.4 | v87.3,8.4 87.3,9 87.1,9.2 80.2,9.2 76.5,12.9 76.5,19.5 77.7,20.7 77.7,21.7 76.5,22.9 v76.5,28.3
SL_C  (via drill 0.4)
  Top 0.203: IC1.30 62.25,10.05 66.3,6 v66.8,6 | v88.9,37.9 89.2,37.6 U$12.P$2
  Bottom 0.203: v66.8,6 66.3,6 62,10.3 62,23.6 71.8,33.4 87.9,33.4 88.9,34.4 v88.9,37.9
SN1  (via drill 0.4)  (3 unrouted)
  Top 0.203: IC1.29 61.35,9.55 66,4.9 v66.8,4.9 | 83.9,8.5 83.9,8.4 85,7.3 90.9,7.3 91.1,7.5 v91.1,8.4
  Top 0.254: 84.25,11.35 84.2,11.4 84.2,11.84 R7.2 82.71,10.81 C12.1 83.9,8.5 U$9.P$1
  Bottom 0.203: v66.8,4.9 67.5,4.2 88,4.2 91.1,7.2 v91.1,8.4
  pour Top (isolate 0.254): 87.69,14.51 82.35,14.5 82.34,11.06 87.67,11.09
SN2  (via drill 0.4)  (3 unrouted)
  Top 0.203: IC1.27 59.95,8.55 65.7,2.8 v66.8,2.8 | v87.1,37.9 87.1,35.54 R4.2
  Top 0.254: 88.05,34.59 R4.2 | U$12.P$1 90.4,37.6 91,37 91,36.67 U$8.1 91.27,37.89 C13.1
  Bottom 0.203: v66.8,2.8 65.7,2.8 61,7.5 61,23.8 72,34.8 86.2,34.8 87.1,35.7 v87.1,37.9
  pour Top (isolate 0.254): 92.2,36.97 86.55,36.96 86.55,33.5 92.2,33.49
SP1  (via drill 0.4)
  Top 0.203: IC1.28 60.65,9.05 65.91,3.85 v66.8,3.85 | v74.9,2.5 74.9,7.54 75.91,8.55 U$2.P$1
  Bottom 0.203: v66.8,3.85 67,3.6 74.4,3.6 74.9,3.1 v74.9,2.5
SP2  (via drill 0.4)
  Top 0.203: v66.8,1.5 65.9,1.5 59.35,8.05 IC1.26 | v80.2,38 U$11.P$1
  Bottom 0.203: v66.8,1.5 65.9,1.5 60,7.4 60,23.9 74.1,38 v80.2,38
VCC3V3  (via drill 0.4, 0.4 pad 0.25)  (33 unrouted)
  Top 0.305: v41.2,8.4 47.8,8.4 48.95,9.55 IC1.20
  Top 0.406: U1.1 43.66,43.5 | 43.66,43.5 43.66,46.34 C32.1 | v44,43.64 43.8,43.64 43.66,43.5
  Route15 0.305: v41.2,8.4 39.3,8.4
  other vias: 44,44.34 44,45.04
  pour Route2 (isolate 0.305, rank 2, no thermals): 0,47.6 39.8,47.6 39.8,0 0,0
  pour Route15 (isolate 0.305, rank 2, no thermals): 0,47.6 39.8,47.6 39.8,0 0,0
  pour Route2 (isolate 0.305, rank 3, no thermals): 39.3,47.6 39.4,28.4 69,28.3 69.23,47.53
VCC5V0
  Top 0.305: 43.5,38.4 44.2,38.4 C31.1
  Top 0.406: U5.5 U5.4 43.84,39.6 U1.8 43.66,38.56 43.5,38.4 41.9,38.4 41.7,38.6 41.7,39.39 U1.5
VCC5V5
  Top 0.254: R10.2 66.5,41.75 U$13.P$2
  Top 0.406: 52,46 48.4,42.4 U5.1 47.94,42.86 47.4,43.4 46.16,43.4 46.06,43.3 | U5.6 48.6,39.6 49,40 49,42.45 C29.1 | U5.3 46.06,43.3 | 46.06,43.3 46.06,46.56 C30.1
  Top 1.422: U$13.P$2 C29.1 | C29.1 52.15,46.15 52,46 52.55,46 C29.1

### Text on the board
tNames: PMSM Driver v1.6 / 6-40 V 40 Amps / http://pavlo.me / (C) - 2013 Pavlo Manovi | V_IN | PVDD | GND | ICSP | MCLR | GND | CAN_L | *FAULT | *OCTW | CAN_H | CS | MOSI | MISO | PWRGD | SCLK | GND | Motor: / W V U | 3.3v | NO SENSITIVE COMPONENTS ABOVE
bNames: Released Under The / TAPR OHL / tapr.org/ohl.html | Licensed under the TAPR OHL | http://www.tapr.org/ohl